# Altium project EPCI.PrjPcb
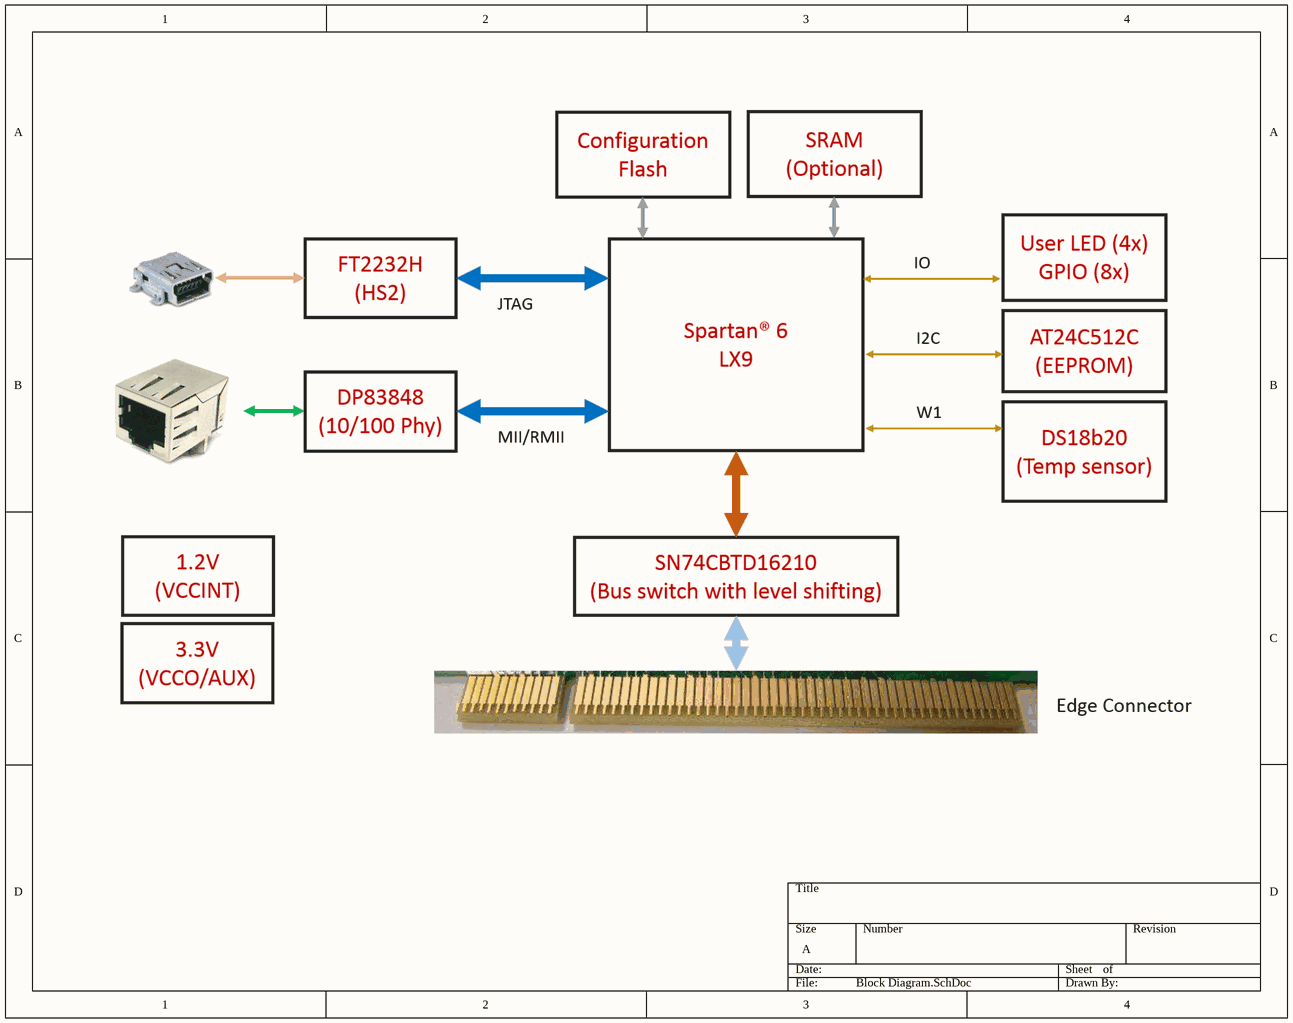
[diagram p0: Block Diagram.SchDoc]
10 sheets, 197 parts. Net scope: flat (ports and power ports of the same name join across sheets).
Board file: EPCI-V1.00.PcbDoc
Sheets:
  Block Diagram.SchDoc
  PCI-connector.SchDoc
  Network.SchDoc
  Power.SchDoc
  Programmer-JTAG.SchDoc
  Bus-switch.SchDoc
  Spartan6-Power.SchDoc
  Spartan6-IO01.SchDoc
  Spartan6-IO23.SchDoc
  Peripherals.SchDoc

## Sheet Block Diagram.SchDoc
size A

## Sheet PCI-connector.SchDoc
size A
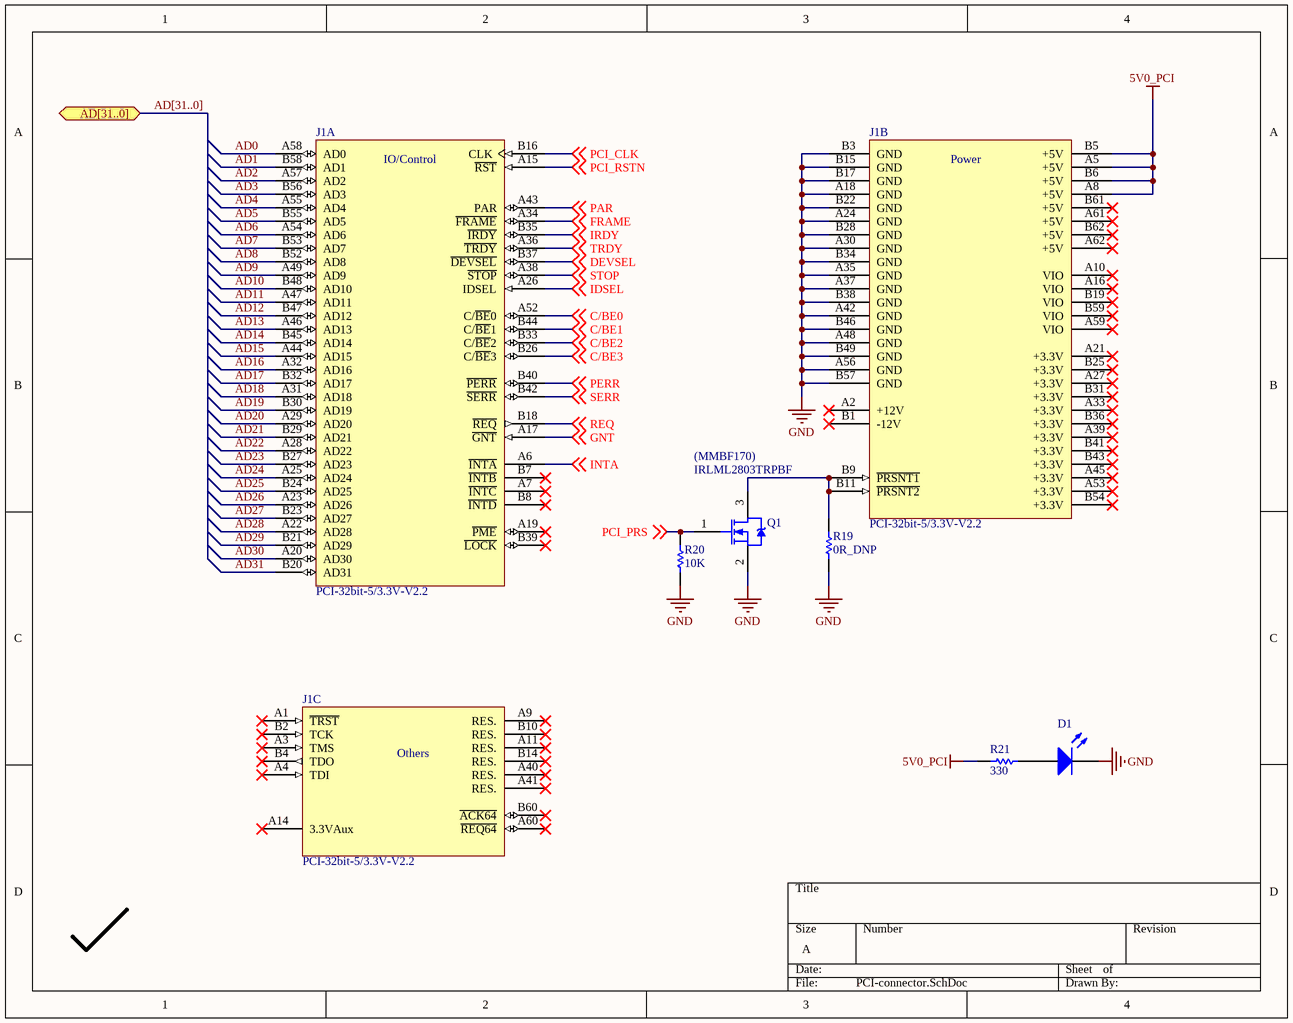
[diagram p1: PCI-connector.SchDoc]

### Parts
D1  LED0  [C0805]  (value not drawn)
J1  PCI-32bit-5/3.3V-V2.2  [PCI-32bit-5/3.3V-V2.2]  (parts A,B,C of 3)
Q1  IRLML2803TRPBF  [SOT23]
R19  value 0R_DNP  [0603PKG]  (hidden comment: Res Semi)
R20  value 10K  [0603PKG]  (hidden comment: Res Semi)
R21  value 330  [0603PKG]  (hidden comment: Res Semi)

### Ports
AD[31..0]

### Nets
5V0_PCI: J1.A5(+5V) J1.A8(+5V) J1.B5(+5V) J1.B6(+5V) R21.2
GND: D1.2(K) J1.A18(GND) J1.A24(GND) J1.A30(GND) J1.A35(GND) J1.A37(GND) J1.A42(GND) J1.A48(GND) J1.A56(GND) J1.B3(GND) J1.B15(GND) J1.B17(GND) J1.B22(GND) J1.B28(GND) J1.B34(GND) J1.B38(GND) J1.B46(GND) J1.B49(GND) J1.B57(GND) Q1.2(S) R19.2 R20.2
AD0: J1.A58(AD0)
AD1: J1.B58(AD1)
AD2: J1.A57(AD2)
AD3: J1.B56(AD3)
AD4: J1.A55(AD4)
AD5: J1.B55(AD5)
AD6: J1.A54(AD6)
AD7: J1.B53(AD7)
AD8: J1.B52(AD8)
AD9: J1.A49(AD9)
AD10: J1.B48(AD10)
AD11: J1.A47(AD11)
AD12: J1.B47(AD12)
AD13: J1.A46(AD13)
AD14: J1.B45(AD14)
AD15: J1.A44(AD15)
AD16: J1.A32(AD16)
AD17: J1.B32(AD17)
AD18: J1.A31(AD18)
AD19: J1.B30(AD19)
AD20: J1.A29(AD20)
AD21: J1.B29(AD21)
AD22: J1.A28(AD22)
AD23: J1.B27(AD23)
AD24: J1.A25(AD24)
AD25: J1.B24(AD25)
AD26: J1.A23(AD26)
AD27: J1.B23(AD27)
AD28: J1.A22(AD28)
AD29: J1.B21(AD29)
AD30: J1.A20(AD30)
AD31: J1.B20(AD31)
C/BE0: J1.A52(C/~{BE}0) ; off-sheet C/BE0
C/BE1: J1.B44(C/~{BE}1) ; off-sheet C/BE1
C/BE2: J1.B33(C/~{BE}2) ; off-sheet C/BE2
C/BE3: J1.B26(C/~{BE}3) ; off-sheet C/BE3
DEVSEL: J1.B37(~{DEVSEL}) ; off-sheet DEVSEL
FRAME: J1.A34(~{FRAME}) ; off-sheet FRAME
GNT: J1.A17(~{GNT}) ; off-sheet GNT
IDSEL: J1.A26(IDSEL) ; off-sheet IDSEL
INTA: J1.A6(~{INTA}) ; off-sheet INTA
IRDY: J1.B35(~{IRDY}) ; off-sheet IRDY
PAR: J1.A43(PAR) ; off-sheet PAR
PCI_CLK: J1.B16(CLK) ; off-sheet PCI_CLK
PCI_PRS: Q1.1(G) R20.1 ; off-sheet PCI_PRS
PCI_RSTN: J1.A15(~{RST}) ; off-sheet PCI_RSTN
PERR: J1.B40(~{PERR}) ; off-sheet PERR
REQ: J1.B18(~{REQ}) ; off-sheet REQ
SERR: J1.B42(~{SERR}) ; off-sheet SERR
STOP: J1.A38(~{STOP}) ; off-sheet STOP
TRDY: J1.A36(~{TRDY}) ; off-sheet TRDY
NetD1_1: D1.1(A) R21.1
NetJ1_B9: J1.B9(~{PRSNT1}) J1.B11(~{PRSNT2}) Q1.3(D) R19.1

Not connected (* = marked no-connect by the designer): J1 A1(~{TRST})* A2(+12V)* A3(TMS)* A4(TDI)* A7(~{INTC})* A9(RES.)* A10(VIO)* A11(RES.)* A14(3.3VAux)* A16(VIO)* A19(~{PME})* A21(+3.3V)* A27(+3.3V)* A33(+3.3V)* A39(+3.3V)* A40(RES.)* A41(RES.)* A45(+3.3V)* A53(+3.3V)* A59(VIO)* A60(~{REQ64})* A61(+5V)* A62(+5V)* B1(-12V)* B2(TCK)* B4(TDO)* B7(~{INTB})* B8(~{INTD})* B10(RES.)* B14(RES.)* B19(VIO)* B25(+3.3V)* B31(+3.3V)* B36(+3.3V)* B39(~{LOCK})* B41(+3.3V)* B43(+3.3V)* B54(+3.3V)* B59(VIO)* B60(~{ACK64})* B61(+5V)* B62(+5V)*

### Buses and harness runs
bus AD[31..0] = port AD[31..0]

### Notes on the sheet
- (MMBF170)
- (in symbol PCI-32bit-5/3.3V-V2.2, part A) IO/Control
- (in symbol PCI-32bit-5/3.3V-V2.2, part B) Power
- (in symbol PCI-32bit-5/3.3V-V2.2, part C) Others

### Library data of the parts
D1 = LED0: Typical INFRARED GaAs LED; Published: 8-Jun-2000; LatestRevisionDate: 08-Jul-2005; LatestRevisionNote: Mech Layer 1 removed.; PackageReference: LED-0; Publisher: Altium Limited; PackageDescription: LED; 2 Leads
Q1 = NMOS-2: N-Channel Power MOSFET; Note: Pin 2 is electrically connected to pin 4.; Published: 8-Jun-2000; LatestRevisionDate: 17-Jul-2002; LatestRevisionNote: Re-released for DXP Platform.; DatasheetVersion: PD-9.814; PackageVersion: Feb-1997; PackageReference: TO-220AB; Publisher: Altium Limited; PackageDescription: TO, Thru-Hole, Vertical, Heatsink Mounted; 3 In-Line Leads; Pitch 2.54 mm; ComponentLink1Description: Manufacturer Link; ComponentLink1URL: http://www.irf.com/
R19-R21 = Res Semi: Semiconductor Resistor; Published: 8-Jun-2000; LatestRevisionDate: 17-Jul-2002; LatestRevisionNote: Re-released for DXP Platform.; PackageReference: AXIAL-0.5; Publisher: Altium Limited; PackageDescription: Axial Device, Thru-Hole; 2 Leads; 0.5 in Pin Spacing

## Sheet Network.SchDoc
size A4
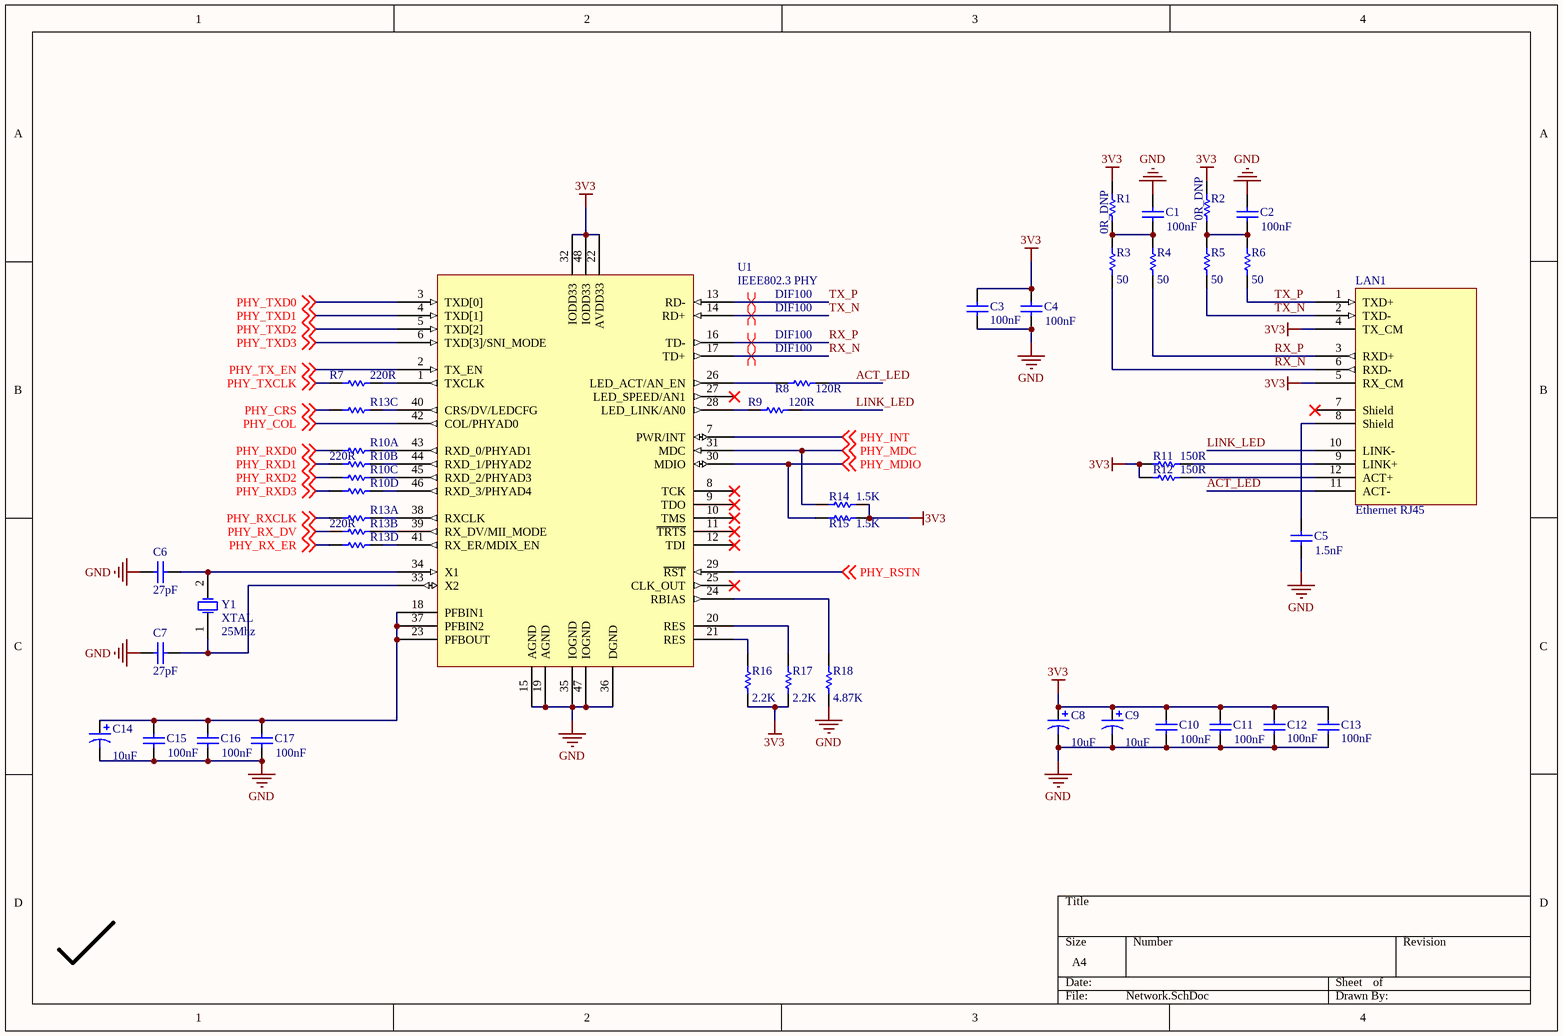
[diagram p2: Network.SchDoc]

### Parts
C1  value 100nF  [0603PKG]  (hidden comment: Cap)
C2  value 100nF  [0603PKG]  (hidden comment: Cap)
C3  value 100nF  [0603PKG]  (hidden comment: Cap)
C4  value 100nF  [0603PKG]  (hidden comment: Cap)
C5  value 1.5nF  [C0805]  (hidden comment: Cap)
C6  value 27pF  [C0805]  (hidden comment: Cap)
C7  value 27pF  [C0805]  (hidden comment: Cap)
C8  value 10uF  [3216X18N]  (hidden comment: Cap Pol3)
C9  value 10uF  [3216X18N]  (hidden comment: Cap Pol3)
C10  value 100nF  [0603PKG]  (hidden comment: Cap)
C11  value 100nF  [0603PKG]  (hidden comment: Cap)
C12  value 100nF  [0603PKG]  (hidden comment: Cap)
C13  value 100nF  [0603PKG]  (hidden comment: Cap)
C14  value 10uF  [3216X18N]  (hidden comment: Cap Pol3)
C15  value 100nF  [0603PKG]  (hidden comment: Cap)
C16  value 100nF  [0603PKG]  (hidden comment: Cap)
C17  value 100nF  [0603PKG]  (hidden comment: Cap)
LAN1  Ethernet RJ45  [RJ45]
R1  value 0R_DNP  [C0805]  (hidden comment: Res Semi)
R2  value 0R_DNP  [C0805]  (hidden comment: Res Semi)
R3  value 50  [C0805]  (hidden comment: Res Semi)
R4  value 50  [C0805]  (hidden comment: Res Semi)
R5  value 50  [C0805]  (hidden comment: Res Semi)
R6  value 50  [C0805]  (hidden comment: Res Semi)
R7  value 220R  [0603PKG]  (hidden comment: Res Semi)
R8  value 120R  [C0805]  (hidden comment: Res Semi)
R9  value 120R  [C0805]  (hidden comment: Res Semi)
R10  value 220R  [ARA4x0603]  (hidden comment: ChipArray_4x)  (parts A,B,C,D of 4)
R11  value 150R  [C0805]  (hidden comment: Res Semi)
R12  value 150R  [C0805]  (hidden comment: Res Semi)
R13  value 220R  [ARA4x0603]  (hidden comment: ChipArray_4x)  (parts A,B,C,D of 4)
R14  value 1.5K  [0603PKG]  (hidden comment: Res Semi)
R15  value 1.5K  [0603PKG]  (hidden comment: Res Semi)
R16  value 2.2K  [0603PKG]  (hidden comment: Res Semi)
R17  value 2.2K  [0603PKG]  (hidden comment: Res Semi)
R18  value 4.87K  [C1206]  (hidden comment: Res Semi)
U1  IEEE802.3 PHY  [LQFP48]
Y1  XTAL  value 25Mhz  [SMD_Crystal]

### Nets
3V3: C3.1 C4.2 C8.1 C9.1 C10.2 C11.2 C12.2 C13.2 LAN1.4(TX_CM) LAN1.5(RX_CM) R1.2 R2.2 R11.1 R12.1 R14.2 R15.1 R16.1 R17.1 U1.22(AVDD33) U1.32(IODD33) U1.48(IODD33)
GND: C1.2 C2.2 C3.2 C4.1 C5.1 C6.2 C7.2 C8.2 C9.2 C10.1 C11.1 C12.1 C13.1 C14.2 C15.1 C16.1 C17.1 R18.1 U1.15(AGND) U1.19(AGND) U1.35(IOGND) U1.36(DGND) U1.47(IOGND)
ACT_LED: LAN1.11(ACT-) R8.2
LINK_LED: LAN1.10(LINK-) R9.2
PHY_COL: U1.42(COL/PHYAD0) ; off-sheet PHY_COL
PHY_CRS: R13.3(R3) ; off-sheet PHY_CRS
PHY_INT: U1.7(PWR/INT) ; off-sheet PHY_INT
PHY_MDC: R14.1 U1.31(MDC) ; off-sheet PHY_MDC
PHY_MDIO: R15.2 U1.30(MDIO) ; off-sheet PHY_MDIO
PHY_RSTN: U1.29(~{RST}) ; off-sheet PHY_RSTN
PHY_RX_DV: R13.2(R2) ; off-sheet PHY_RX_DV
PHY_RX_ER: R13.4(R4) ; off-sheet PHY_RX_ER
PHY_RXCLK: R13.1(R1) ; off-sheet PHY_RXCLK
PHY_RXD0: R10.1(R1) ; off-sheet PHY_RXD0
PHY_RXD1: R10.2(R2) ; off-sheet PHY_RXD1
PHY_RXD2: R10.3(R3) ; off-sheet PHY_RXD2
PHY_RXD3: R10.4(R4) ; off-sheet PHY_RXD3
PHY_TX_EN: U1.2(TX_EN) ; off-sheet PHY_TX_EN
PHY_TXCLK: R7.1 ; off-sheet PHY_TXCLK
PHY_TXD0: U1.3(TXD[0]) ; off-sheet PHY_TXD0
PHY_TXD1: U1.4(TXD[1]) ; off-sheet PHY_TXD1
PHY_TXD2: U1.5(TXD[2]) ; off-sheet PHY_TXD2
PHY_TXD3: U1.6(TXD[3]/SNI_MODE) ; off-sheet PHY_TXD3
RX_N: LAN1.6(RXD-) R3.1 U1.17(TD+)
RX_P: LAN1.3(RXD+) R4.1 U1.16(TD-)
TX_N: LAN1.2(TXD-) R5.1 U1.14(RD+)
TX_P: LAN1.1(TXD+) R6.1 U1.13(RD-)
NetC1_1: C1.1 R1.1 R3.2 R4.2
NetC2_1: C2.1 R2.1 R5.2 R6.2
NetC5_2: C5.2 LAN1.8(Shield)
NetC6_1: C6.1 U1.34(X1) Y1.2(OSC2)
NetC7_1: C7.1 U1.33(X2) Y1.1(OSC1)
NetC14_1: C14.1 C15.2 C16.2 C17.2 U1.18(PFBIN1) U1.23(PFBOUT) U1.37(PFBIN2)
NetLAN1_9: LAN1.9(LINK+) R11.2
NetLAN1_12: LAN1.12(ACT+) R12.2
NetR7_2: R7.2 U1.1(TXCLK)
NetR8_1: R8.1 U1.26(LED_ACT/AN_EN)
NetR9_1: R9.1 U1.28(LED_LINK/AN0)
NetR10_5: R10.5(R4) U1.46(RXD_3/PHYAD4)
NetR10_6: R10.6(R3) U1.45(RXD_2/PHYAD3)
NetR10_7: R10.7(R2) U1.44(RXD_1/PHYAD2)
NetR10_8: R10.8(R1) U1.43(RXD_0/PHYAD1)
NetR13_5: R13.5(R4) U1.41(RX_ER/MDIX_EN)
NetR13_6: R13.6(R3) U1.40(CRS/DV/LEDCFG)
NetR13_7: R13.7(R2) U1.39(RX_DV/MII_MODE)
NetR13_8: R13.8(R1) U1.38(RXCLK)
NetR16_2: R16.2 U1.21(RES)
NetR17_2: R17.2 U1.20(RES)
NetR18_2: R18.2 U1.24(RBIAS)

Not connected (* = marked no-connect by the designer): LAN1 7(Shield)*; U1 8(TCK)* 9(TDO)* 10(TMS)* 11(~{TRTS})* 12(TDI)* 25(CLK_OUT)* 27(LED_SPEED/AN1)*

### Layout directives
differential pair; net class DIF100: RX_N, RX_P, TX_N, TX_P

### Library data of the parts
C1-C7 C10-C13 C15-C17 = Cap: Capacitor; Published: 8-Jun-2000; LatestRevisionDate: 17-Jul-2002; LatestRevisionNote: Re-released for DXP Platform.; PackageReference: RAD-0.3; Publisher: Altium Limited; PackageDescription: Radial Cap, Thru-Hole; 2 Leads; 0.3 in Pin Spacing
C8 C9 C14 = Cap Pol3: Polarized Capacitor (Surface Mount); Published: 8-Jun-2000; LatestRevisionDate: 29-May-2009; LatestRevisionNote: IPC-7351 Footprint Added.; PackageReference: C0805; Publisher: Altium Limited; PackageDescription: Chip Capacitor
LAN1 = Ethernet_RJ45
R1-R9 R11 R12 R14-R18 = Res Semi: Semiconductor Resistor; Published: 8-Jun-2000; LatestRevisionDate: 17-Jul-2002; LatestRevisionNote: Re-released for DXP Platform.; PackageReference: AXIAL-0.5; Publisher: Altium Limited; PackageDescription: Axial Device, Thru-Hole; 2 Leads; 0.5 in Pin Spacing
U1 = DP83848C
Y1 = XTAL: Crystal Oscillator; Published: 8-Jun-2000; LatestRevisionDate: 17-Jul-2002; LatestRevisionNote: Re-released for DXP Platform.; PackageReference: R38; Publisher: Altium Limited; PackageDescription: Crystal, Thru-Hole; 2 Leads; Body 3.1 x 8.2 mm (Dia.xH)

## Sheet Power.SchDoc
size A
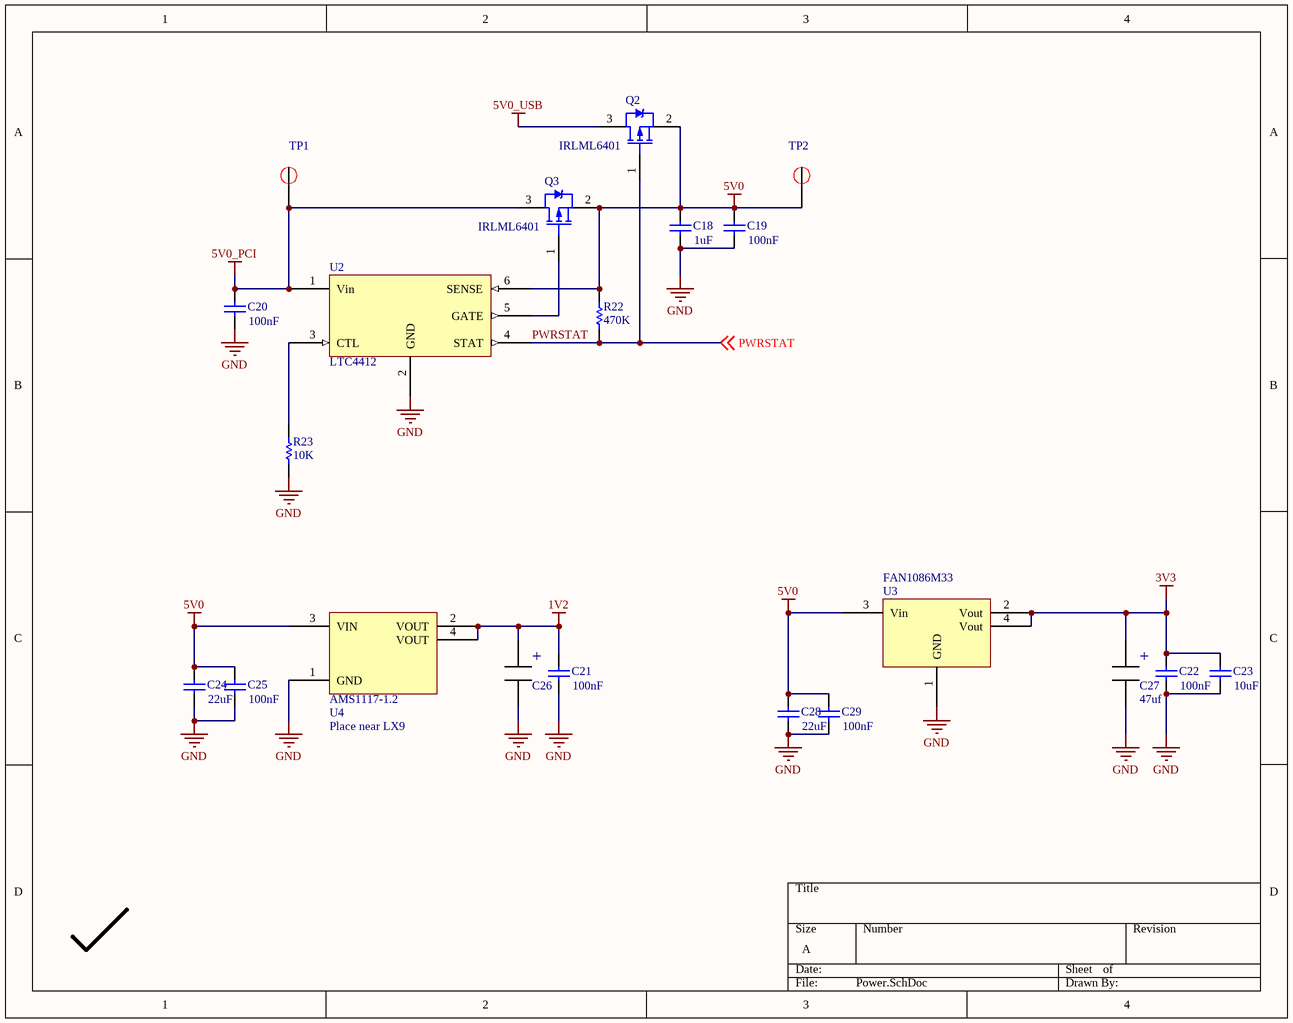
[diagram p3: Power.SchDoc]

### Parts
C18  value 1uF  [0603PKG]  (hidden comment: Cap)
C19  value 100nF  [0603PKG]  (hidden comment: Cap)
C20  value 100nF  [0603PKG]  (hidden comment: Cap)
C21  value 100nF  [C0805]  (hidden comment: Cap)
C22  value 100nF  [C0805]  (hidden comment: Cap)
C23  value 10uF  [C0805]  (hidden comment: Cap)
C24  value 22uF  [C1206]  (hidden comment: Cap)
C25  value 100nF  [C0805]  (hidden comment: Cap)
C26  Capacitor  [Capacitor]  (value not drawn)
C27  value 47uf  [Capacitor]  (hidden comment: Capacitor)
C28  value 22uF  [C1206]  (hidden comment: Cap)
C29  value 100nF  [C0805]  (hidden comment: Cap)
Q2  IRLML6401  [SOT23]
Q3  IRLML6401  [SOT23]
R22  value 470K  [0603PKG]  (hidden comment: Res Semi)
R23  value 10K  [0603PKG]  (hidden comment: Res Semi)
TP1  TP  [TP_15]  (value not drawn)
TP2  TP  [TP_15]  (value not drawn)
U2  LTC4412  [SOT23-6]
U3  FAN1086M33  [TO263]
U4  AMS1117-1.2  [SOT223]

### Nets
1V2: C21.2 C26.2 U4.2(VOUT) U4.4(VOUT)
3V3: C22.2 C23.2 C27.2 U3.2(Vout) U3.4(Vout)
5V0: C18.2 C19.2 C24.2 C25.2 C28.2 C29.2 Q2.2(S) Q3.2(S) R22.2 TP2.1 U2.6(SENSE) U3.3(Vin) U4.3(VIN)
5V0_PCI: C20.2 Q3.3(D) TP1.1 U2.1(Vin)
5V0_USB: Q2.3(D)
GND: C18.1 C19.1 C20.1 C21.1 C22.1 C23.1 C24.1 C25.1 C26.1 C27.1 C28.1 C29.1 R23.1 U2.2(GND) U3.1(GND) U4.1(GND)
PWRSTAT: Q2.1(G) R22.1 U2.4(STAT) ; off-sheet PWRSTAT
NetQ3_1: Q3.1(G) U2.5(GATE)
NetR23_2: R23.2 U2.3(CTL)

### Notes on the sheet
- (near U4) Place near LX9
- (in symbol SMS capacitor) +

### Library data of the parts
C18-C25 C28 C29 = Cap: Capacitor; Published: 8-Jun-2000; LatestRevisionDate: 17-Jul-2002; LatestRevisionNote: Re-released for DXP Platform.; PackageReference: RAD-0.3; Publisher: Altium Limited; PackageDescription: Radial Cap, Thru-Hole; 2 Leads; 0.3 in Pin Spacing
C26 = SMS capacitor: Value: 47uf
C27 = SMS capacitor
Q2 Q3 = PMOS-2: P-Channel Power MOSFET; Note: Pin 4 not drawn and electrically connected to Pin 2.; Published: 8-Jun-2000; LatestRevisionDate: 17-Jul-2002; LatestRevisionNote: Re-released for DXP Platform.; DatasheetVersion: PD-9.390D; PackageVersion: Feb-1997; PackageReference: TO-220AB; Publisher: Altium Limited; PackageDescription: TO, Thru-Hole, Vertical, Heatsink Mounted; 3 In-Line Leads; Pitch 2.54 mm; ComponentLink1Description: Manufacturer Link; ComponentLink1URL: http://www.irf.com/
R22 R23 = Res Semi: Semiconductor Resistor; Published: 8-Jun-2000; LatestRevisionDate: 17-Jul-2002; LatestRevisionNote: Re-released for DXP Platform.; PackageReference: AXIAL-0.5; Publisher: Altium Limited; PackageDescription: Axial Device, Thru-Hole; 2 Leads; 0.5 in Pin Spacing
TP1 TP2 = Test Point
U2 = LTC4412: Low Loss PowerPath™  Controller in ThinSOT
U4 = AMS1117-1.2: 1A Adjustable/Fixed Low Dropout Linear Regulator

## Sheet Programmer-JTAG.SchDoc
size A
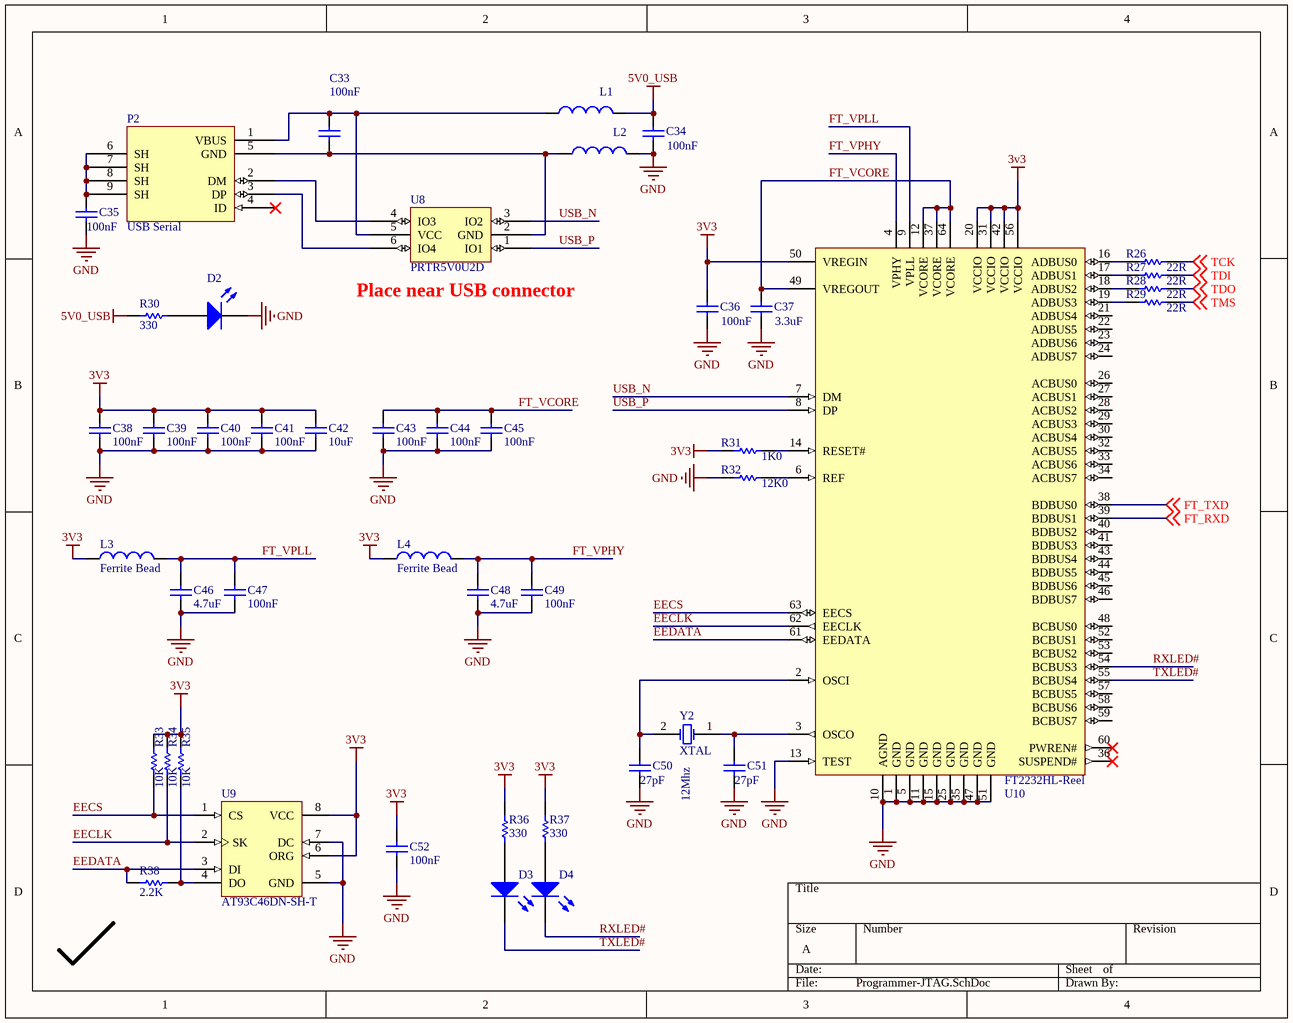
[diagram p4: Programmer-JTAG.SchDoc]

### Parts
C33  value 100nF  [C0805]  (hidden comment: Cap)
C34  value 100nF  [C0805]  (hidden comment: Cap)
C35  value 100nF  [C0805]  (hidden comment: Cap)
C36  value 100nF  [0603PKG]  (hidden comment: Cap)
C37  value 3.3uF  [C0805]  (hidden comment: Cap)
C38  value 100nF  [0603PKG]  (hidden comment: Cap Semi)
C39  value 100nF  [0603PKG]  (hidden comment: Cap Semi)
C40  value 100nF  [0603PKG]  (hidden comment: Cap Semi)
C41  value 100nF  [0603PKG]  (hidden comment: Cap Semi)
C42  value 10uF  [0603PKG]  (hidden comment: Cap Semi)
C43  value 100nF  [0603PKG]  (hidden comment: Cap Semi)
C44  value 100nF  [0603PKG]  (hidden comment: Cap Semi)
C45  value 100nF  [0603PKG]  (hidden comment: Cap Semi)
C46  value 4.7uF  [0603PKG]  (hidden comment: Cap Semi)
C47  value 100nF  [0603PKG]  (hidden comment: Cap Semi)
C48  value 4.7uF  [0603PKG]  (hidden comment: Cap Semi)
C49  value 100nF  [0603PKG]  (hidden comment: Cap Semi)
C50  value 27pF  [0603PKG]  (hidden comment: Cap)
C51  value 27pF  [0603PKG]  (hidden comment: Cap)
C52  value 100nF  [0603PKG]  (hidden comment: Cap Semi)
D2  LED0  [C0805]  (value not drawn)
D3  LED0  [C0805]  (value not drawn)
D4  LED0  [C0805]  (value not drawn)
L1  Ferrite Bead  [C0805]  (value not drawn)
L2  Ferrite Bead  [C0805]  (value not drawn)
L3  Ferrite Bead  [C0805]
L4  Ferrite Bead  [C0805]
P2  USB Serial  [Mini USB]
R26  value 22R  [0603PKG]  (hidden comment: Res Semi)
R27  value 22R  [0603PKG]  (hidden comment: Res Semi)
R28  value 22R  [0603PKG]  (hidden comment: Res Semi)
R29  value 22R  [0603PKG]  (hidden comment: Res Semi)
R30  value 330  [0603PKG]  (hidden comment: Res Semi)
R31  value 1K0  [0603PKG]  (hidden comment: Res Semi)
R32  value 12K0  [0603PKG]  (hidden comment: Res Semi)
R33  value 10K  [0603PKG]  (hidden comment: Res Semi)
R34  value 10K  [0603PKG]  (hidden comment: Res Semi)
R35  value 10K  [0603PKG]  (hidden comment: Res Semi)
R36  value 330  [0603PKG]  (hidden comment: Res Semi)
R37  value 330  [0603PKG]  (hidden comment: Res Semi)
R38  value 2.2K  [0603PKG]  (hidden comment: Res Semi)
U8  PRTR5V0U2D  [SOT457]
U9  AT93C46DN-SH-T  [8S1_N]
U10  FT2232HL-Reel  [LQFP-64_N]
Y2  XTAL  value 12Mhz  [SMD_Crystal]

### Nets
3V3: C36.2 C38.2 C39.2 C40.2 C41.2 C42.2 C52.2 L3.1 L4.1 R31.2 R33.1 R34.1 R35.1 R36.2 R37.2 U9.6(ORG) U9.8(VCC) U10.20(VCCIO) U10.31(VCCIO) U10.42(VCCIO) U10.50(VREGIN) U10.56(VCCIO)
5V0_USB: C34.2 L1.2 R30.2
GND: C34.1 C35.1 C36.1 C37.1 C38.1 C39.1 C40.1 C41.1 C42.1 C43.1 C44.1 C45.1 C46.1 C47.1 C48.1 C49.1 C50.1 C51.1 C52.1 D2.2(K) L2.2 R32.2 U9.5(GND) U9.7(DC) U10.1(GND) U10.5(GND) U10.10(AGND) U10.11(GND) U10.13(TEST) U10.15(GND) U10.25(GND) U10.35(GND) U10.47(GND) U10.51(GND)
EECLK: R34.2 U9.2(SK) U10.62(EECLK)
EECS: R33.2 U9.1(CS) U10.63(EECS)
EEDATA: R38.2 U9.3(DI) U10.61(EEDATA)
FT_RXD: U10.39(BDBUS1) ; off-sheet FT_RXD
FT_TXD: U10.38(BDBUS0) ; off-sheet FT_TXD
FT_VCORE: C37.2 C43.2 C44.2 C45.2 U10.12(VCORE) U10.37(VCORE) U10.49(VREGOUT) U10.64(VCORE)
FT_VPHY: C48.2 C49.2 L4.2 U10.4(VPHY)
FT_VPLL: C46.2 C47.2 L3.2 U10.9(VPLL)
RXLED#: D4.2(K) U10.54(BCBUS3)
TCK: R26.1 ; off-sheet TCK
TDI: R27.1 ; off-sheet TDI
TDO: R28.1 ; off-sheet TDO
TMS: R29.1 ; off-sheet TMS
TXLED#: D3.2(K) U10.55(BCBUS4)
USB_N: U8.3(IO2) U10.7(DM)
USB_P: U8.1(IO1) U10.8(DP)
NetC33_1: C33.1 L2.1 P2.5(GND) U8.2(GND)
NetC33_2: C33.2 L1.1 P2.1(VBUS) U8.5(VCC)
NetC35_2: C35.2 P2.6(SH) P2.7(SH) P2.8(SH) P2.9(SH)
NetC50_2: C50.2 U10.2(OSCI) Y2.2(OSC2)
NetC51_2: C51.2 U10.3(OSCO) Y2.1(OSC1)
NetD2_1: D2.1(A) R30.1
NetD3_1: D3.1(A) R36.1
NetD4_1: D4.1(A) R37.1
NetP2_2: P2.2(DM) U8.4(IO3)
NetP2_3: P2.3(DP) U8.6(IO4)
NetR26_2: R26.2 U10.16(ADBUS0)
NetR27_2: R27.2 U10.17(ADBUS1)
NetR28_2: R28.2 U10.18(ADBUS2)
NetR29_2: R29.2 U10.19(ADBUS3)
NetR31_1: R31.1 U10.14(RESET#)
NetR32_1: R32.1 U10.6(REF)
NetR35_2: R35.2 R38.1 U9.4(DO)

Not connected (* = marked no-connect by the designer): P2 4(ID)*; U10 21(ADBUS4) 22(ADBUS5) 23(ADBUS6) 24(ADBUS7) 26(ACBUS0) 27(ACBUS1) 28(ACBUS2) 29(ACBUS3) 30(ACBUS4) 32(ACBUS5) 33(ACBUS6) 34(ACBUS7) 36(SUSPEND#)* 40(BDBUS2) 41(BDBUS3) 43(BDBUS4) 44(BDBUS5) 45(BDBUS6) 46(BDBUS7) 48(BCBUS0) 52(BCBUS1) 53(BCBUS2) 57(BCBUS5) 58(BCBUS6) 59(BCBUS7) 60(PWREN#)*

### Notes on the sheet
- (near U8) Place near USB connector

### Library data of the parts
C33-C37 C50 C51 = Cap: Capacitor; Published: 8-Jun-2000; LatestRevisionDate: 17-Jul-2002; LatestRevisionNote: Re-released for DXP Platform.; PackageReference: RAD-0.3; Publisher: Altium Limited; PackageDescription: Radial Cap, Thru-Hole; 2 Leads; 0.3 in Pin Spacing
C38-C49 C52 = Cap Semi: Capacitor (Semiconductor SIM Model); Published: 8-Jun-2000; LatestRevisionDate: 29-May-2009; LatestRevisionNote: IPC-7351 Footprint Added.; PackageReference: C1206; Publisher: Altium Limited; PackageDescription: Chip Capacitor
D2-D4 = LED0: Typical INFRARED GaAs LED; Published: 8-Jun-2000; LatestRevisionDate: 08-Jul-2005; LatestRevisionNote: Mech Layer 1 removed.; PackageReference: LED-0; Publisher: Altium Limited; PackageDescription: LED; 2 Leads
L1-L4 = Inductor: Code_IEC: 1005; Value: 10mH; Published: 8-Jun-2000; LatestRevisionDate: 29-May-2009; LatestRevisionNote: IPC-7351 Footprint Added.; PackageReference: 0402-A; Publisher: Altium Limited; PackageDescription: Chip Inductor; Code_JEITA: 0402
P2 = Mini USB
R26-R38 = Res Semi: Semiconductor Resistor; Published: 8-Jun-2000; LatestRevisionDate: 17-Jul-2002; LatestRevisionNote: Re-released for DXP Platform.; PackageReference: AXIAL-0.5; Publisher: Altium Limited; PackageDescription: Axial Device, Thru-Hole; 2 Leads; 0.5 in Pin Spacing
U8 = PRTR5V0U2D: TVS Zener
U9 = AT93C46DN-SP25-B: 1Kbit (128 x 8 or 64 x 16), 3-wire Bus Serial Automotive EEPROM, 2.5V, 8-Pin SOIC, Bulk; DatasheetVersion: 8674B,  Oct-2009; PackageVersion: revC, Mar-2005; PackageReference: 8S1; PackageDescription: 8-Lead (0.150" Wide Body), Plastic Gull Wing Small Outline (JEDEC SOIC); Code_JEDEC: MS-012-AA; Code_IPC: SOIC127P600-8; ComponentLink1Description: Manufacturer URL; ComponentLink1URL: http://www.atmel.com/; ComponentLink2Description: Datasheet; ComponentLink2URL: http://www.atmel.com/dyn/resources/prod_documents/doc8674.pdf
U10 = FT2232HL-Reel: Dual High Speed USB To Multipurpose UART/FIFO IC, 64-pin LQFP, Tape and Reel; Manufacturer: FTDI; DatasheetVersion: ver 2.21, Jun-2012; PackageVersion: Jun-12; PackageReference: LQFP-64; PackageDescription: 64-Pin Thin Quad Flat Pack, 10 x 10 x 1.4 mm Body, 0.5 mm Pitch; PartNumber: FT2232HL-Reel; ComponentLink1Description: Manufacturer URL; ComponentLink1URL: http://www.ftdichip.com/; ComponentLink2Description: Datasheet; ComponentLink2URL: http://www.ftdichip.com/Support/Documents/DataSheets/ICs/DS_FT2232H.pdf
Y2 = XTAL: Crystal Oscillator; Published: 8-Jun-2000; LatestRevisionDate: 17-Jul-2002; LatestRevisionNote: Re-released for DXP Platform.; PackageReference: R38; Publisher: Altium Limited; PackageDescription: Crystal, Thru-Hole; 2 Leads; Body 3.1 x 8.2 mm (Dia.xH)

## Sheet Bus-switch.SchDoc
size B
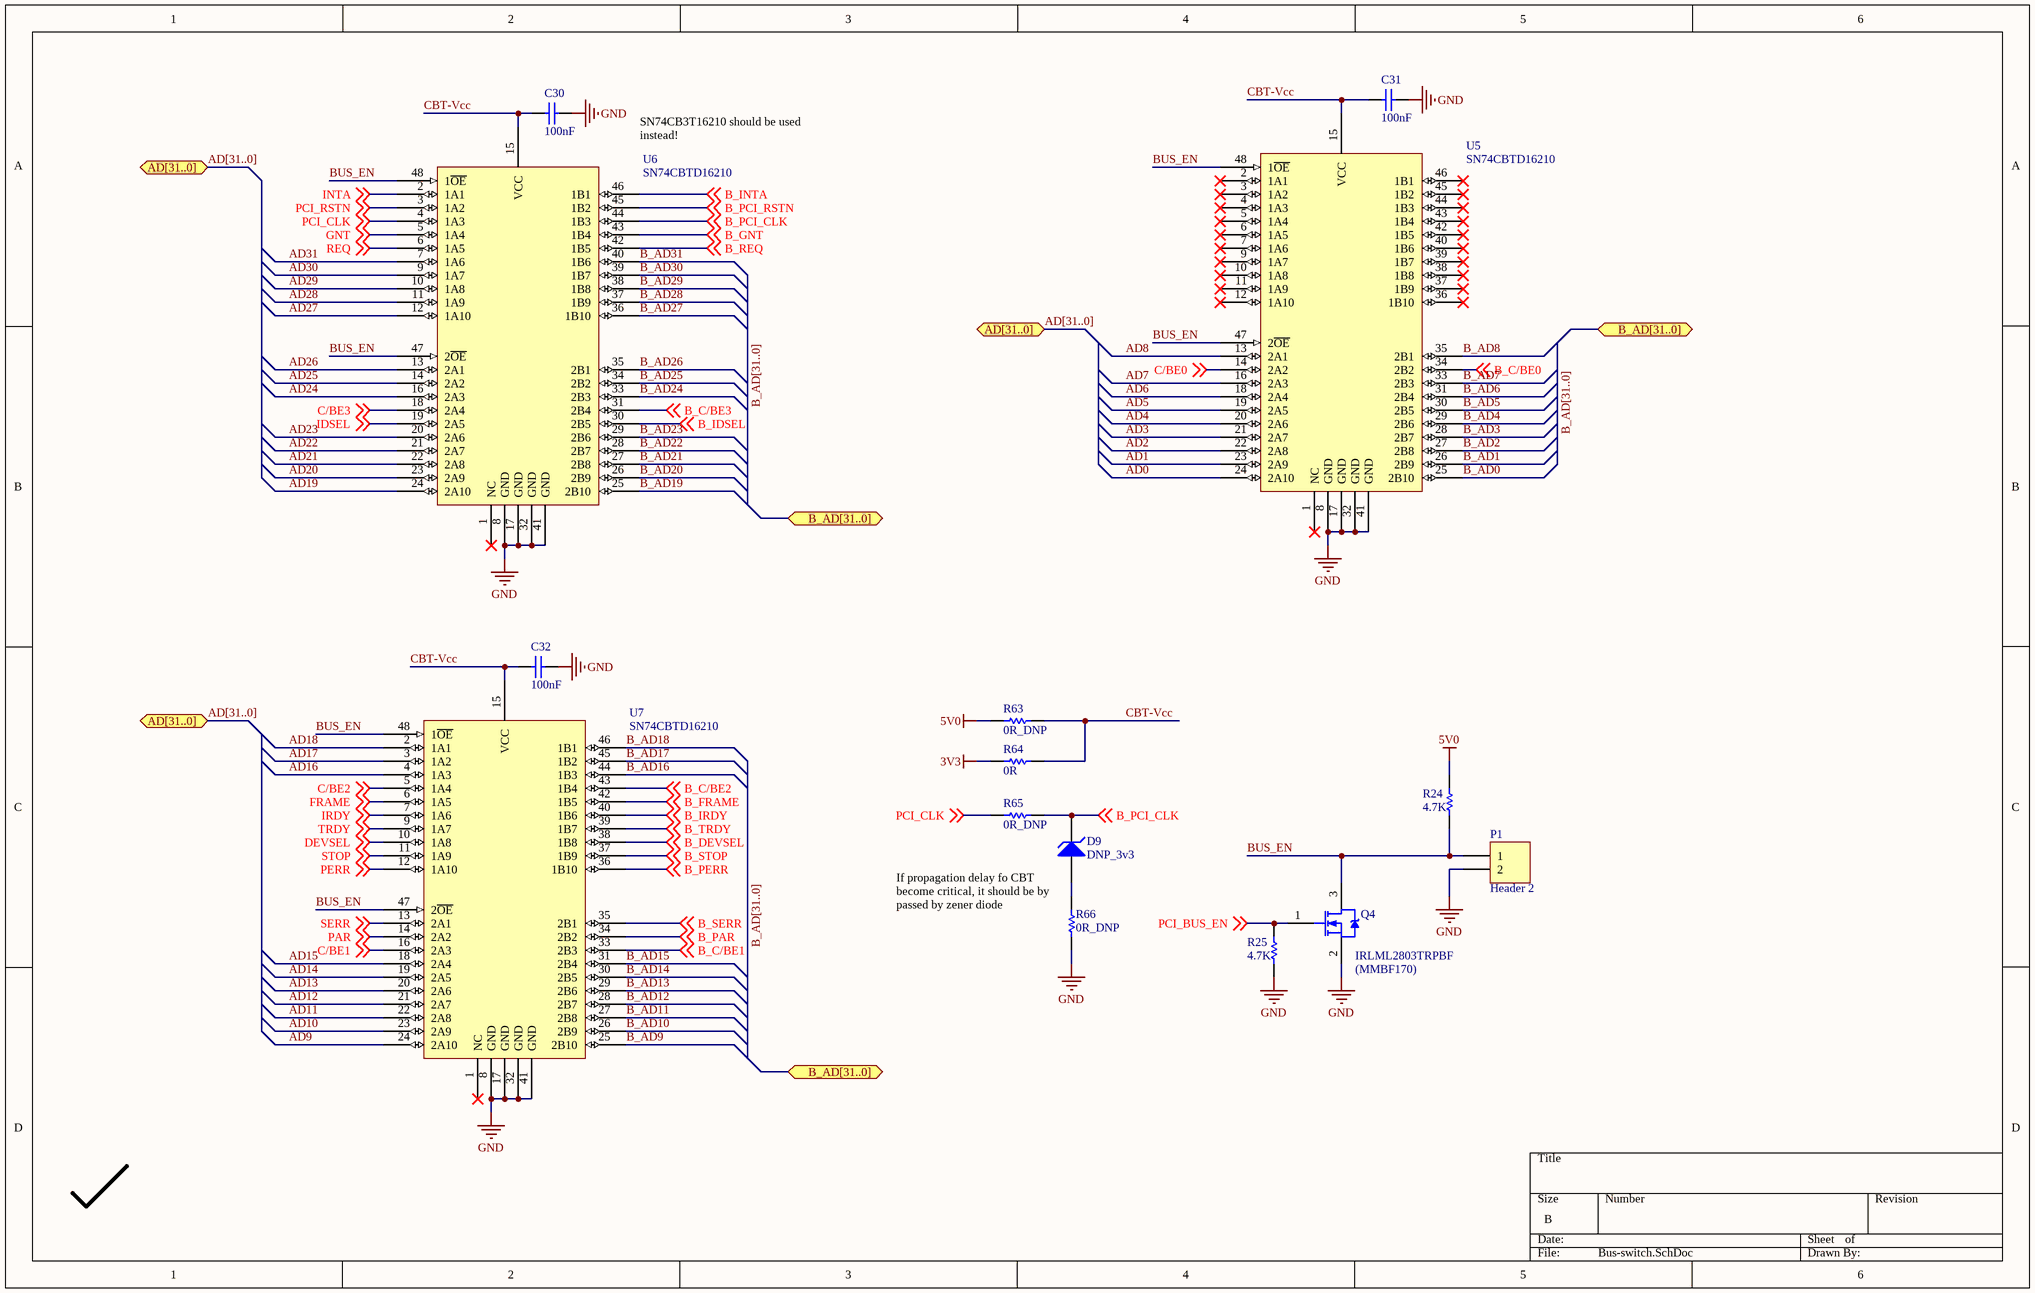
[diagram p5: Bus-switch.SchDoc]

### Parts
C30  value 100nF  [0603PKG]  (hidden comment: Cap Semi)
C31  value 100nF  [0603PKG]  (hidden comment: Cap Semi)
C32  value 100nF  [0603PKG]  (hidden comment: Cap Semi)
D9  DNP_3v3  [C1206]
P1  Header 2  [HDR1X2]
Q4  IRLML2803TRPBF  [SOT23]
R24  value 4.7K  [0603PKG]  (hidden comment: Res1)
R25  value 4.7K  [0603PKG]  (hidden comment: Res1)
R63  value 0R_DNP  [0603PKG]  (hidden comment: Res1)
R64  value 0R  [0603PKG]  (hidden comment: Res1)
R65  value 0R_DNP  [0603PKG]  (hidden comment: Res1)
R66  value 0R_DNP  [0603PKG]  (hidden comment: Res1)
U5  SN74CBTD16210  [TSSOP-48-DGG]
U6  SN74CBTD16210  [TSSOP-48-DGG]
U7  SN74CBTD16210  [TSSOP-48-DGG]

### Ports
AD[31..0], B_AD[31..0]

### Nets
3V3: R64.2
5V0: R24.2 R63.2
GND: C30.1 C31.1 C32.1 P1.2 Q4.2(S) R25.1 R66.2 U5.8(GND) U5.17(GND) U5.32(GND) U5.41(GND) U6.8(GND) U6.17(GND) U6.32(GND) U6.41(GND) U7.8(GND) U7.17(GND) U7.32(GND) U7.41(GND)
AD0: U5.24(2A10)
AD1: U5.23(2A9)
AD2: U5.22(2A8)
AD3: U5.21(2A7)
AD4: U5.20(2A6)
AD5: U5.19(2A5)
AD6: U5.18(2A4)
AD7: U5.16(2A3)
AD8: U5.13(2A1)
AD9: U7.24(2A10)
AD10: U7.23(2A9)
AD11: U7.22(2A8)
AD12: U7.21(2A7)
AD13: U7.20(2A6)
AD14: U7.19(2A5)
AD15: U7.18(2A4)
AD16: U7.4(1A3)
AD17: U7.3(1A2)
AD18: U7.2(1A1)
AD19: U6.24(2A10)
AD20: U6.23(2A9)
AD21: U6.22(2A8)
AD22: U6.21(2A7)
AD23: U6.20(2A6)
AD24: U6.16(2A3)
AD25: U6.14(2A2)
AD26: U6.13(2A1)
AD27: U6.12(1A10)
AD28: U6.11(1A9)
AD29: U6.10(1A8)
AD30: U6.9(1A7)
AD31: U6.7(1A6)
B_AD0: U5.25(2B10)
B_AD1: U5.26(2B9)
B_AD2: U5.27(2B8)
B_AD3: U5.28(2B7)
B_AD4: U5.29(2B6)
B_AD5: U5.30(2B5)
B_AD6: U5.31(2B4)
B_AD7: U5.33(2B3)
B_AD8: U5.35(2B1)
B_AD9: U7.25(2B10)
B_AD10: U7.26(2B9)
B_AD11: U7.27(2B8)
B_AD12: U7.28(2B7)
B_AD13: U7.29(2B6)
B_AD14: U7.30(2B5)
B_AD15: U7.31(2B4)
B_AD16: U7.44(1B3)
B_AD17: U7.45(1B2)
B_AD18: U7.46(1B1)
B_AD19: U6.25(2B10)
B_AD20: U6.26(2B9)
B_AD21: U6.27(2B8)
B_AD22: U6.28(2B7)
B_AD23: U6.29(2B6)
B_AD24: U6.33(2B3)
B_AD25: U6.34(2B2)
B_AD26: U6.35(2B1)
B_AD27: U6.36(1B10)
B_AD28: U6.37(1B9)
B_AD29: U6.38(1B8)
B_AD30: U6.39(1B7)
B_AD31: U6.40(1B6)
B_C/BE0: U5.34(2B2) ; off-sheet B_C/BE0
B_C/BE1: U7.33(2B3) ; off-sheet B_C/BE1
B_C/BE2: U7.43(1B4) ; off-sheet B_C/BE2
B_C/BE3: U6.31(2B4) ; off-sheet B_C/BE3
B_DEVSEL: U7.38(1B8) ; off-sheet B_DEVSEL
B_FRAME: U7.42(1B5) ; off-sheet B_FRAME
B_GNT: U6.43(1B4) ; off-sheet B_GNT
B_IDSEL: U6.30(2B5) ; off-sheet B_IDSEL
B_INTA: U6.46(1B1) ; off-sheet B_INTA
B_IRDY: U7.40(1B6) ; off-sheet B_IRDY
B_PAR: U7.34(2B2) ; off-sheet B_PAR
B_PCI_CLK: D9.2(K) R65.1 U6.44(1B3) ; off-sheet B_PCI_CLK
B_PCI_RSTN: U6.45(1B2) ; off-sheet B_PCI_RSTN
B_PERR: U7.36(1B10) ; off-sheet B_PERR
B_REQ: U6.42(1B5) ; off-sheet B_REQ
B_SERR: U7.35(2B1) ; off-sheet B_SERR
B_STOP: U7.37(1B9) ; off-sheet B_STOP
B_TRDY: U7.39(1B7) ; off-sheet B_TRDY
BUS_EN: P1.1 Q4.3(D) R24.1 U5.47(2~{OE}) U5.48(1~{OE}) U6.47(2~{OE}) U6.48(1~{OE}) U7.47(2~{OE}) U7.48(1~{OE})
C/BE0: U5.14(2A2) ; off-sheet C/BE0
C/BE1: U7.16(2A3) ; off-sheet C/BE1
C/BE2: U7.5(1A4) ; off-sheet C/BE2
C/BE3: U6.18(2A4) ; off-sheet C/BE3
CBT-Vcc: C30.2 C31.2 C32.2 R63.1 R64.1 U5.15(VCC) U6.15(VCC) U7.15(VCC)
DEVSEL: U7.10(1A8) ; off-sheet DEVSEL
FRAME: U7.6(1A5) ; off-sheet FRAME
GNT: U6.5(1A4) ; off-sheet GNT
IDSEL: U6.19(2A5) ; off-sheet IDSEL
INTA: U6.2(1A1) ; off-sheet INTA
IRDY: U7.7(1A6) ; off-sheet IRDY
PAR: U7.14(2A2) ; off-sheet PAR
PCI_BUS_EN: Q4.1(G) R25.2 ; off-sheet PCI_BUS_EN
PCI_CLK: R65.2 U6.4(1A3) ; off-sheet PCI_CLK
PCI_RSTN: U6.3(1A2) ; off-sheet PCI_RSTN
PERR: U7.12(1A10) ; off-sheet PERR
REQ: U6.6(1A5) ; off-sheet REQ
SERR: U7.13(2A1) ; off-sheet SERR
STOP: U7.11(1A9) ; off-sheet STOP
TRDY: U7.9(1A7) ; off-sheet TRDY
NetD9_1: D9.1(A) R66.1

Not connected (* = marked no-connect by the designer): U5 1(NC)* 2(1A1)* 3(1A2)* 4(1A3)* 5(1A4)* 6(1A5)* 7(1A6)* 9(1A7)* 10(1A8)* 11(1A9)* 12(1A10)* 36(1B10)* 37(1B9)* 38(1B8)* 39(1B7)* 40(1B6)* 42(1B5)* 43(1B4)* 44(1B3)* 45(1B2)* 46(1B1)*; U6 1(NC)*; U7 1(NC)*

### Buses and harness runs
bus AD[31..0] = port AD[31..0]
bus B_AD[31..0] = port B_AD[31..0]

### Notes on the sheet
- (near U6) SN74CB3T16210 should be used instead!
- If propagation delay fo CBT become critical, it should be by passed by zener diode
- (near Q4) (MMBF170)

### Library data of the parts
C30-C32 = Cap Semi: Capacitor (Semiconductor SIM Model); Published: 8-Jun-2000; LatestRevisionDate: 29-May-2009; LatestRevisionNote: IPC-7351 Footprint Added.; PackageReference: C1206; Publisher: Altium Limited; PackageDescription: Chip Capacitor
D9 = D Zener: Zener Diode; Published: 8-Jun-2000; LatestRevisionDate: 17-Jul-2002; LatestRevisionNote: Re-released for DXP Platform.; PackageReference: DIODE-0.7; Publisher: Altium Limited; PackageDescription: Diode, Thru-Hole; 2 Leads; 0.7 in Pin Spacing
P1 = Header 2: Header, 2-Pin; LatestRevisionDate: 17-Jul-2002; LatestRevisionNote: Re-released for DXP Platform.; Publisher: Altium Limited
Q4 = NMOS-2: as Q1 on sheet PCI-connector; Published: 8-Jun-2000; LatestRevisionDate: 17-Jul-2002; LatestRevisionNote: Re-released for DXP Platform.; DatasheetVersion: PD-9.814; PackageVersion: Feb-1997; PackageReference: TO-220AB; Publisher: Altium Limited; PackageDescription: TO, Thru-Hole, Vertical, Heatsink Mounted; 3 In-Line Leads; Pitch 2.54 mm; ComponentLink1Description: Manufacturer Link; ComponentLink1URL: http://www.irf.com/
R24 R25 R63-R66 = Res1: Resistor; Published: 8-Jun-2000; LatestRevisionDate: 17-Jul-2002; LatestRevisionNote: Re-released for DXP Platform.; PackageReference: AXIAL-0.3; Publisher: Altium Limited; PackageDescription: Axial Device, Thru-Hole; 2 Leads; 0.3 in Pin Spacing
U5-U7 = SN74CBTD16210: 20-BIT FET BUS SWITCH WITH LEVEL SHIFTING

## Sheet Spartan6-Power.SchDoc
size A
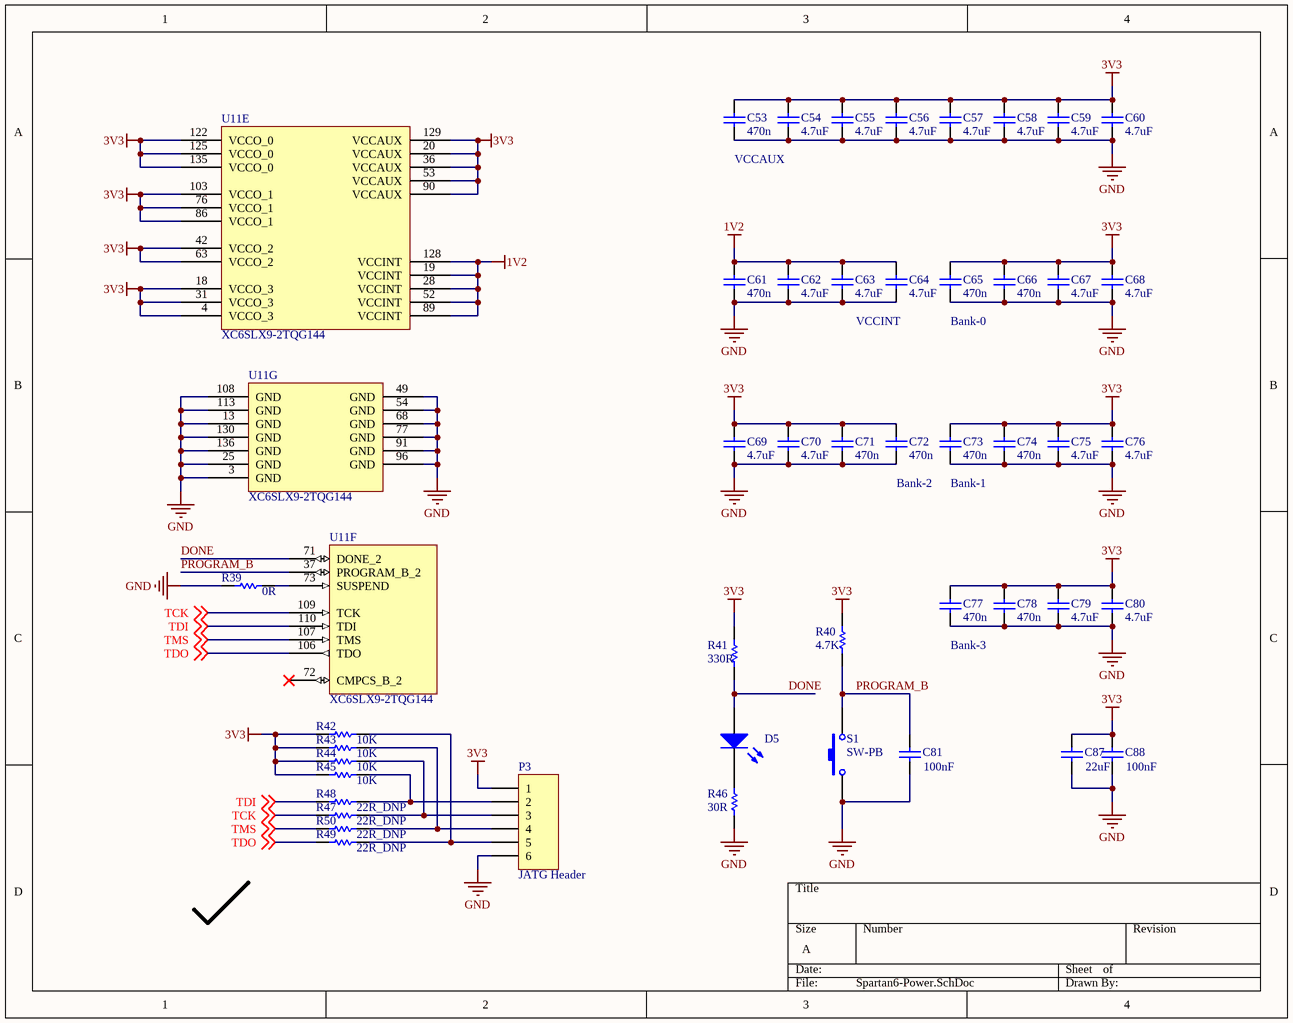
[diagram p6: Spartan6-Power.SchDoc]

### Parts
C53  value 470n  [0402]  (hidden comment: Cap Semi)
C54  value 4.7uF  [0603PKG]  (hidden comment: Cap Semi)
C55  value 4.7uF  [0603PKG]  (hidden comment: Cap Semi)
C56  value 4.7uF  [0603PKG]  (hidden comment: Cap Semi)
C57  value 4.7uF  [0603PKG]  (hidden comment: Cap Semi)
C58  value 4.7uF  [0603PKG]  (hidden comment: Cap Semi)
C59  value 4.7uF  [0603PKG]  (hidden comment: Cap Semi)
C60  value 4.7uF  [0603PKG]  (hidden comment: Cap Semi)
C61  value 470n  [0402]  (hidden comment: Cap Semi)
C62  value 4.7uF  [0603PKG]  (hidden comment: Cap Semi)
C63  value 4.7uF  [0603PKG]  (hidden comment: Cap Semi)
C64  value 4.7uF  [0603PKG]  (hidden comment: Cap Semi)
C65  value 470n  [0402]  (hidden comment: Cap Semi)
C66  value 470n  [0402]  (hidden comment: Cap Semi)
C67  value 4.7uF  [0603PKG]  (hidden comment: Cap Semi)
C68  value 4.7uF  [0603PKG]  (hidden comment: Cap Semi)
C69  value 4.7uF  [0603PKG]  (hidden comment: Cap Semi)
C70  value 4.7uF  [0603PKG]  (hidden comment: Cap Semi)
C71  value 470n  [0402]  (hidden comment: Cap Semi)
C72  value 470n  [0402]  (hidden comment: Cap Semi)
C73  value 470n  [0402]  (hidden comment: Cap Semi)
C74  value 470n  [0402]  (hidden comment: Cap Semi)
C75  value 4.7uF  [0603PKG]  (hidden comment: Cap Semi)
C76  value 4.7uF  [0603PKG]  (hidden comment: Cap Semi)
C77  value 470n  [0402]  (hidden comment: Cap Semi)
C78  value 470n  [0402]  (hidden comment: Cap Semi)
C79  value 4.7uF  [0603PKG]  (hidden comment: Cap Semi)
C80  value 4.7uF  [0603PKG]  (hidden comment: Cap Semi)
C81  value 100nF  [C0805]  (hidden comment: Cap)
C87  value 22uF  [C1206]  (hidden comment: Cap)
C88  value 100nF  [C0805]  (hidden comment: Cap)
D5  LED0  [C0805]  (value not drawn)
P3  JATG Header  [HDR1X6]
R39  value 0R  [0603PKG]  (hidden comment: Res1)
R40  value 4.7K  [0603PKG]  (hidden comment: Res1)
R41  value 330R  [0603PKG]  (hidden comment: Res1)
R42  value 10K  [0603PKG]  (hidden comment: Res Semi)
R43  value 10K  [0603PKG]  (hidden comment: Res Semi)
R44  value 10K  [0603PKG]  (hidden comment: Res Semi)
R45  value 10K  [0603PKG]  (hidden comment: Res Semi)
R46  value 30R  [0603PKG]  (hidden comment: Res1)
R47  value 22R_DNP  [0603PKG]  (hidden comment: Res Semi)
R48  value 22R_DNP  [0603PKG]  (hidden comment: Res Semi)
R49  value 22R_DNP  [0603PKG]  (hidden comment: Res Semi)
R50  value 22R_DNP  [0603PKG]  (hidden comment: Res Semi)
S1  SW-PB  [SMD push button]
U11  XC6SLX9-2TQG144  [TQG144]  (parts E,F,G of 7)

### Nets
1V2: C61.1 C62.1 C63.1 C64.1 U11.19(VCCINT) U11.28(VCCINT) U11.52(VCCINT) U11.89(VCCINT) U11.128(VCCINT)
3V3: C53.1 C54.1 C55.1 C56.1 C57.1 C58.1 C59.1 C60.1 C65.1 C66.1 C67.1 C68.1 C69.1 C70.1 C71.1 C72.1 C73.1 C74.1 C75.1 C76.1 C77.1 C78.1 C79.1 C80.1 C87.2 C88.2 P3.1 R40.2 R41.2 R42.2 R43.2 R44.2 R45.2 U11.4(VCCO_3) U11.18(VCCO_3) U11.20(VCCAUX) U11.31(VCCO_3) U11.36(VCCAUX) U11.42(VCCO_2) U11.53(VCCAUX) U11.63(VCCO_2) U11.76(VCCO_1) U11.86(VCCO_1) U11.90(VCCAUX) U11.103(VCCO_1) U11.122(VCCO_0) U11.125(VCCO_0) U11.129(VCCAUX) U11.135(VCCO_0)
GND: C53.2 C54.2 C55.2 C56.2 C57.2 C58.2 C59.2 C60.2 C61.2 C62.2 C63.2 C64.2 C65.2 C66.2 C67.2 C68.2 C69.2 C70.2 C71.2 C72.2 C73.2 C74.2 C75.2 C76.2 C77.2 C78.2 C79.2 C80.2 C81.1 C87.1 C88.1 P3.6 R39.1 R46.1 S1.1 U11.3(GND) U11.13(GND) U11.25(GND) U11.49(GND) U11.54(GND) U11.68(GND) U11.77(GND) U11.91(GND) U11.96(GND) U11.108(GND) U11.113(GND) U11.130(GND) U11.136(GND)
DONE: D5.1(A) R41.1 U11.71(DONE_2)
PROGRAM_B: C81.2 R40.1 S1.2 U11.37(PROGRAM_B_2)
TCK: R47.2 U11.109(TCK) ; off-sheet TCK
TDI: R48.2 U11.110(TDI) ; off-sheet TDI
TDO: R49.2 U11.106(TDO) ; off-sheet TDO
TMS: R50.2 U11.107(TMS) ; off-sheet TMS
NetD5_2: D5.2(K) R46.2
NetP3_2: P3.2 R45.1 R48.1
NetP3_3: P3.3 R44.1 R47.1
NetP3_4: P3.4 R43.1 R50.1
NetP3_5: P3.5 R42.1 R49.1
NetR39_2: R39.2 U11.73(SUSPEND)

Not connected (* = marked no-connect by the designer): U11 72(CMPCS_B_2)*

### Notes on the sheet
- VCCAUX
- VCCINT
- Bank-0
- Bank-2
- Bank-1
- Bank-3

### Library data of the parts
C53-C80 = Cap Semi: Capacitor (Semiconductor SIM Model); Published: 8-Jun-2000; LatestRevisionDate: 29-May-2009; LatestRevisionNote: IPC-7351 Footprint Added.; PackageReference: C1206; Publisher: Altium Limited; PackageDescription: Chip Capacitor
C81 C87 C88 = Cap: Capacitor; Published: 8-Jun-2000; LatestRevisionDate: 17-Jul-2002; LatestRevisionNote: Re-released for DXP Platform.; PackageReference: RAD-0.3; Publisher: Altium Limited; PackageDescription: Radial Cap, Thru-Hole; 2 Leads; 0.3 in Pin Spacing
D5 = LED0: Typical INFRARED GaAs LED; Published: 8-Jun-2000; LatestRevisionDate: 08-Jul-2005; LatestRevisionNote: Mech Layer 1 removed.; PackageReference: LED-0; Publisher: Altium Limited; PackageDescription: LED; 2 Leads
P3 = Header 6: Header, 6-Pin; LatestRevisionDate: 17-Jul-2002; LatestRevisionNote: Re-released for DXP Platform.; Publisher: Altium Limited
R39-R41 R46 = Res1: Resistor; Published: 8-Jun-2000; LatestRevisionDate: 17-Jul-2002; LatestRevisionNote: Re-released for DXP Platform.; PackageReference: AXIAL-0.3; Publisher: Altium Limited; PackageDescription: Axial Device, Thru-Hole; 2 Leads; 0.3 in Pin Spacing
R42-R45 R47-R50 = Res Semi: Semiconductor Resistor; Published: 8-Jun-2000; LatestRevisionDate: 17-Jul-2002; LatestRevisionNote: Re-released for DXP Platform.; PackageReference: AXIAL-0.5; Publisher: Altium Limited; PackageDescription: Axial Device, Thru-Hole; 2 Leads; 0.5 in Pin Spacing
S1 = SW-PB: Switch; Published: 24-Mar-1999; LatestRevisionDate: 17-Jul-2002; LatestRevisionNote: Re-released for DXP Platform.; PackageReference: SPST-2; Publisher: Altium Limited; PackageDescription: Switch; 2 Leads
U11 = XC6SLX9-2TQG144C: Xilinx Spartan6 LX9

## Sheet Spartan6-IO01.SchDoc
size A
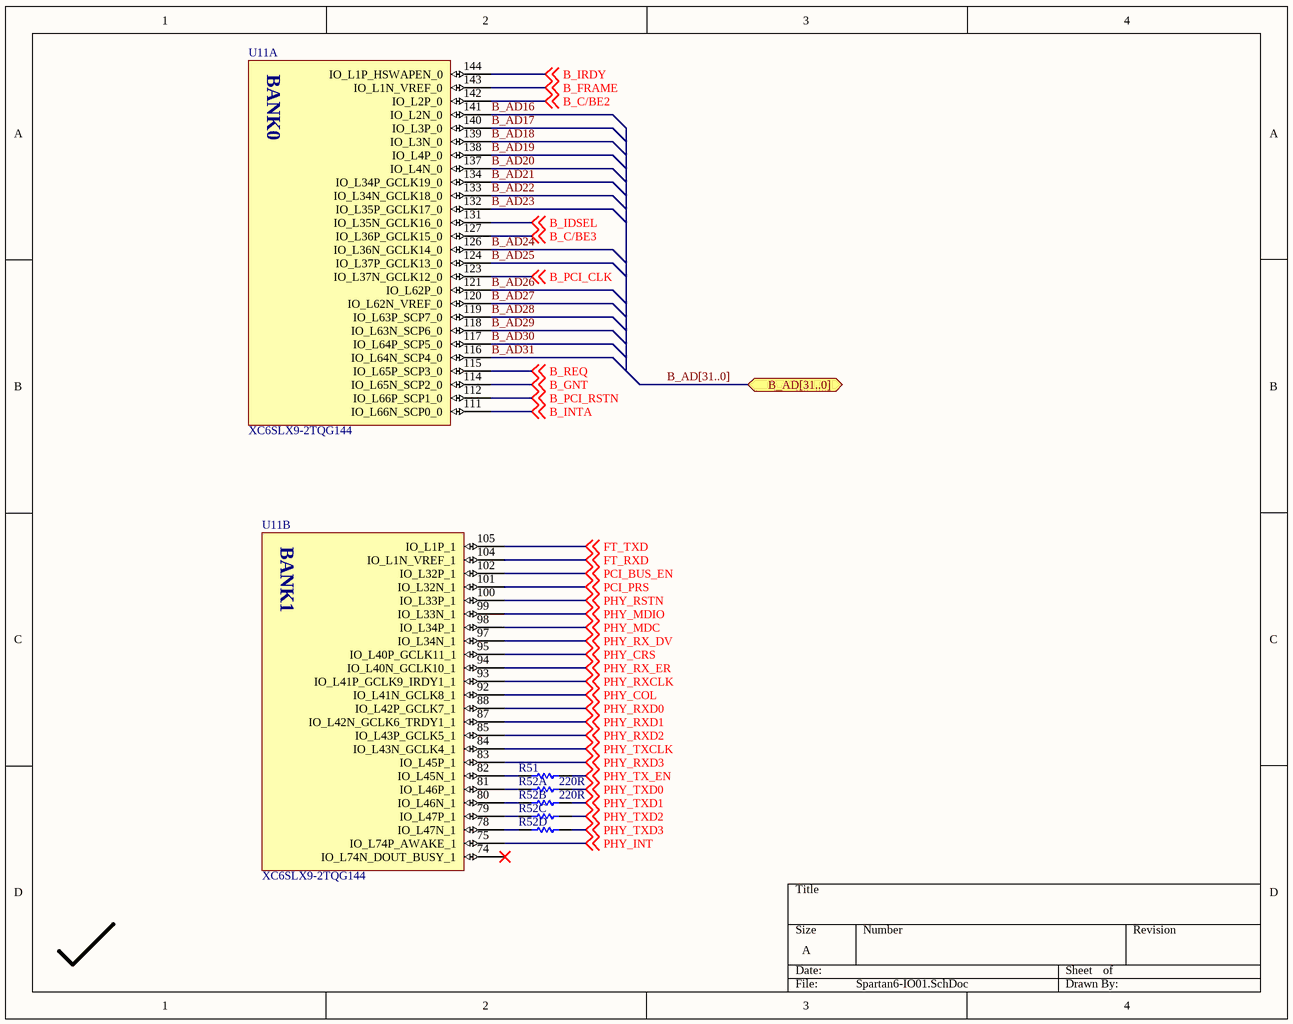
[diagram p7: Spartan6-IO01.SchDoc]

### Parts
R51  value 220R  [0603PKG]  (hidden comment: Res Semi)
R52  value 220R  [ARA4x0603]  (hidden comment: ChipArray_4x)  (parts A,B,C,D of 4)
U11  XC6SLX9-2TQG144  [TQG144]  (parts A,B of 7)

### Ports
B_AD[31..0]

### Nets
B_AD16: U11.141(IO_L2N_0)
B_AD17: U11.140(IO_L3P_0)
B_AD18: U11.139(IO_L3N_0)
B_AD19: U11.138(IO_L4P_0)
B_AD20: U11.137(IO_L4N_0)
B_AD21: U11.134(IO_L34P_GCLK19_0)
B_AD22: U11.133(IO_L34N_GCLK18_0)
B_AD23: U11.132(IO_L35P_GCLK17_0)
B_AD24: U11.126(IO_L36N_GCLK14_0)
B_AD25: U11.124(IO_L37P_GCLK13_0)
B_AD26: U11.121(IO_L62P_0)
B_AD27: U11.120(IO_L62N_VREF_0)
B_AD28: U11.119(IO_L63P_SCP7_0)
B_AD29: U11.118(IO_L63N_SCP6_0)
B_AD30: U11.117(IO_L64P_SCP5_0)
B_AD31: U11.116(IO_L64N_SCP4_0)
B_C/BE2: U11.142(IO_L2P_0) ; off-sheet B_C/BE2
B_C/BE3: U11.127(IO_L36P_GCLK15_0) ; off-sheet B_C/BE3
B_FRAME: U11.143(IO_L1N_VREF_0) ; off-sheet B_FRAME
B_GNT: U11.114(IO_L65N_SCP2_0) ; off-sheet B_GNT
B_IDSEL: U11.131(IO_L35N_GCLK16_0) ; off-sheet B_IDSEL
B_INTA: U11.111(IO_L66N_SCP0_0) ; off-sheet B_INTA
B_IRDY: U11.144(IO_L1P_HSWAPEN_0) ; off-sheet B_IRDY
B_PCI_CLK: U11.123(IO_L37N_GCLK12_0) ; off-sheet B_PCI_CLK
B_PCI_RSTN: U11.112(IO_L66P_SCP1_0) ; off-sheet B_PCI_RSTN
B_REQ: U11.115(IO_L65P_SCP3_0) ; off-sheet B_REQ
FT_RXD: U11.104(IO_L1N_VREF_1) ; off-sheet FT_RXD
FT_TXD: U11.105(IO_L1P_1) ; off-sheet FT_TXD
PCI_BUS_EN: U11.102(IO_L32P_1) ; off-sheet PCI_BUS_EN
PCI_PRS: U11.101(IO_L32N_1) ; off-sheet PCI_PRS
PHY_COL: U11.92(IO_L41N_GCLK8_1) ; off-sheet PHY_COL
PHY_CRS: U11.95(IO_L40P_GCLK11_1) ; off-sheet PHY_CRS
PHY_INT: U11.75(IO_L74P_AWAKE_1) ; off-sheet PHY_INT
PHY_MDC: U11.98(IO_L34P_1) ; off-sheet PHY_MDC
PHY_MDIO: U11.99(IO_L33N_1) ; off-sheet PHY_MDIO
PHY_RSTN: U11.100(IO_L33P_1) ; off-sheet PHY_RSTN
PHY_RX_DV: U11.97(IO_L34N_1) ; off-sheet PHY_RX_DV
PHY_RX_ER: U11.94(IO_L40N_GCLK10_1) ; off-sheet PHY_RX_ER
PHY_RXCLK: U11.93(IO_L41P_GCLK9_IRDY1_1) ; off-sheet PHY_RXCLK
PHY_RXD0: U11.88(IO_L42P_GCLK7_1) ; off-sheet PHY_RXD0
PHY_RXD1: U11.87(IO_L42N_GCLK6_TRDY1_1) ; off-sheet PHY_RXD1
PHY_RXD2: U11.85(IO_L43P_GCLK5_1) ; off-sheet PHY_RXD2
PHY_RXD3: U11.83(IO_L45P_1) ; off-sheet PHY_RXD3
PHY_TX_EN: R51.2 ; off-sheet PHY_TX_EN
PHY_TXCLK: U11.84(IO_L43N_GCLK4_1) ; off-sheet PHY_TXCLK
PHY_TXD0: R52.8(R1) ; off-sheet PHY_TXD0
PHY_TXD1: R52.7(R2) ; off-sheet PHY_TXD1
PHY_TXD2: R52.6(R3) ; off-sheet PHY_TXD2
PHY_TXD3: R52.5(R4) ; off-sheet PHY_TXD3
NetR51_1: R51.1 U11.82(IO_L45N_1)
NetR52_1: R52.1(R1) U11.81(IO_L46P_1)
NetR52_2: R52.2(R2) U11.80(IO_L46N_1)
NetR52_3: R52.3(R3) U11.79(IO_L47P_1)
NetR52_4: R52.4(R4) U11.78(IO_L47N_1)

Not connected (* = marked no-connect by the designer): U11 74(IO_L74N_DOUT_BUSY_1)*

### Buses and harness runs
bus B_AD[31..0] = port B_AD[31..0]

### Notes on the sheet
- (in symbol XC6SLX9-2TQG144C, part A) BANK0
- (in symbol XC6SLX9-2TQG144C, part B) BANK1

### Library data of the parts
R51 = Res Semi: Semiconductor Resistor; Published: 8-Jun-2000; LatestRevisionDate: 17-Jul-2002; LatestRevisionNote: Re-released for DXP Platform.; PackageReference: AXIAL-0.5; Publisher: Altium Limited; PackageDescription: Axial Device, Thru-Hole; 2 Leads; 0.5 in Pin Spacing
U11 = XC6SLX9-2TQG144C: Xilinx Spartan6 LX9

## Sheet Spartan6-IO23.SchDoc
size A
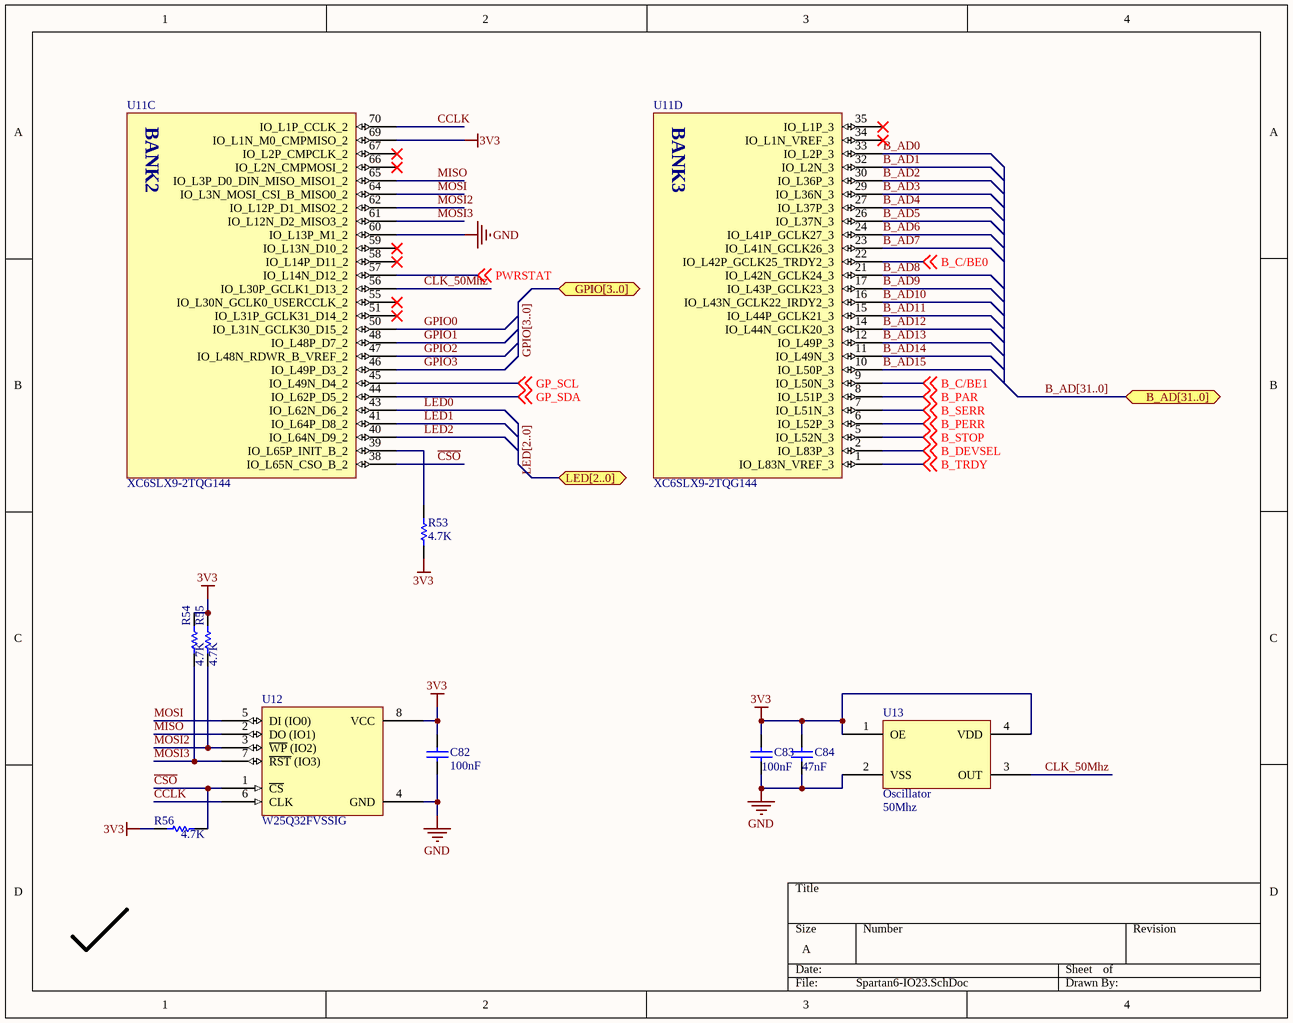
[diagram p8: Spartan6-IO23.SchDoc]

### Parts
C82  value 100nF  [0603PKG]  (hidden comment: Cap Semi)
C83  value 100nF  [0603PKG]  (hidden comment: Cap)
C84  value 47nF  [0603PKG]  (hidden comment: Cap)
R53  value 4.7K  [0603PKG]  (hidden comment: Res1)
R54  value 4.7K  [0603PKG]  (hidden comment: Res1)
R55  value 4.7K  [0603PKG]  (hidden comment: Res1)
R56  value 4.7K  [0603PKG]  (hidden comment: Res1)
U11  XC6SLX9-2TQG144  [TQG144]  (parts C,D of 7)
U12  W25Q32FVSSIG  [SSOP8]
U13  Oscillator  Freq: 50Mhz  [Crystal5x7]

### Ports
B_AD[31..0], GPIO[3..0], LED[2..0]

### Nets
3V3: C82.1 C83.2 C84.2 R53.2 R54.2 R55.2 R56.1 U11.69(IO_L1N_M0_CMPMISO_2) U12.8(VCC) U13.1(OE) U13.4(VDD)
GND: C82.2 C83.1 C84.1 U11.60(IO_L13P_M1_2) U12.4(GND) U13.2(VSS)
B_AD0: U11.33(IO_L2P_3)
B_AD1: U11.32(IO_L2N_3)
B_AD2: U11.30(IO_L36P_3)
B_AD3: U11.29(IO_L36N_3)
B_AD4: U11.27(IO_L37P_3)
B_AD5: U11.26(IO_L37N_3)
B_AD6: U11.24(IO_L41P_GCLK27_3)
B_AD7: U11.23(IO_L41N_GCLK26_3)
B_AD8: U11.21(IO_L42N_GCLK24_3)
B_AD9: U11.17(IO_L43P_GCLK23_3)
B_AD10: U11.16(IO_L43N_GCLK22_IRDY2_3)
B_AD11: U11.15(IO_L44P_GCLK21_3)
B_AD12: U11.14(IO_L44N_GCLK20_3)
B_AD13: U11.12(IO_L49P_3)
B_AD14: U11.11(IO_L49N_3)
B_AD15: U11.10(IO_L50P_3)
B_C/BE0: U11.22(IO_L42P_GCLK25_TRDY2_3) ; off-sheet B_C/BE0
B_C/BE1: U11.9(IO_L50N_3) ; off-sheet B_C/BE1
B_DEVSEL: U11.2(IO_L83P_3) ; off-sheet B_DEVSEL
B_PAR: U11.8(IO_L51P_3) ; off-sheet B_PAR
B_PERR: U11.6(IO_L52P_3) ; off-sheet B_PERR
B_SERR: U11.7(IO_L51N_3) ; off-sheet B_SERR
B_STOP: U11.5(IO_L52N_3) ; off-sheet B_STOP
B_TRDY: U11.1(IO_L83N_VREF_3) ; off-sheet B_TRDY
~{CSO}: R56.2 U11.38(IO_L65N_CSO_B_2) U12.1(~{CS})
CCLK: U11.70(IO_L1P_CCLK_2) U12.6(CLK)
CLK_50Mhz: U11.56(IO_L30P_GCLK1_D13_2) U13.3(OUT)
GP_SCL: U11.45(IO_L49N_D4_2) ; off-sheet GP_SCL
GP_SDA: U11.44(IO_L62P_D5_2) ; off-sheet GP_SDA
GPIO0: U11.50(IO_L31N_GCLK30_D15_2)
GPIO1: U11.48(IO_L48P_D7_2)
GPIO2: U11.47(IO_L48N_RDWR_B_VREF_2)
GPIO3: U11.46(IO_L49P_D3_2)
LED0: U11.43(IO_L62N_D6_2)
LED1: U11.41(IO_L64P_D8_2)
LED2: U11.40(IO_L64N_D9_2)
MISO: U11.65(IO_L3P_D0_DIN_MISO_MISO1_2) U12.2(DO_(IO1))
MOSI: U11.64(IO_L3N_MOSI_CSI_B_MISO0_2) U12.5(DI_(IO0))
MOSI2: R55.1 U11.62(IO_L12P_D1_MISO2_2) U12.3(~{WP}_(IO2))
MOSI3: R54.1 U11.61(IO_L12N_D2_MISO3_2) U12.7(~{RST}_(IO3))
PWRSTAT: U11.57(IO_L14N_D12_2) ; off-sheet PWRSTAT
NetR53_1: R53.1 U11.39(IO_L65P_INIT_B_2)

Not connected (* = marked no-connect by the designer): U11 34(IO_L1N_VREF_3)* 35(IO_L1P_3)* 51(IO_L31P_GCLK31_D14_2)* 55(IO_L30N_GCLK0_USERCCLK_2)* 58(IO_L14P_D11_2)* 59(IO_L13N_D10_2)* 66(IO_L2N_CMPMOSI_2)* 67(IO_L2P_CMPCLK_2)*

### Buses and harness runs
bus B_AD[31..0] = port B_AD[31..0]
bus GPIO[3..0] = port GPIO[3..0]
bus LED[2..0] = port LED[2..0]

### Notes on the sheet
- (in symbol XC6SLX9-2TQG144C, part C) BANK2
- (in symbol XC6SLX9-2TQG144C, part D) BANK3

### Library data of the parts
C82 = Cap Semi: Capacitor (Semiconductor SIM Model); Published: 8-Jun-2000; LatestRevisionDate: 29-May-2009; LatestRevisionNote: IPC-7351 Footprint Added.; PackageReference: C1206; Publisher: Altium Limited; PackageDescription: Chip Capacitor
C83 C84 = Cap: Capacitor; Published: 8-Jun-2000; LatestRevisionDate: 17-Jul-2002; LatestRevisionNote: Re-released for DXP Platform.; PackageReference: RAD-0.3; Publisher: Altium Limited; PackageDescription: Radial Cap, Thru-Hole; 2 Leads; 0.3 in Pin Spacing
R53-R56 = Res1: Resistor; Published: 8-Jun-2000; LatestRevisionDate: 17-Jul-2002; LatestRevisionNote: Re-released for DXP Platform.; PackageReference: AXIAL-0.3; Publisher: Altium Limited; PackageDescription: Axial Device, Thru-Hole; 2 Leads; 0.3 in Pin Spacing
U11 = XC6SLX9-2TQG144C: Xilinx Spartan6 LX9

## Sheet Peripherals.SchDoc
size A
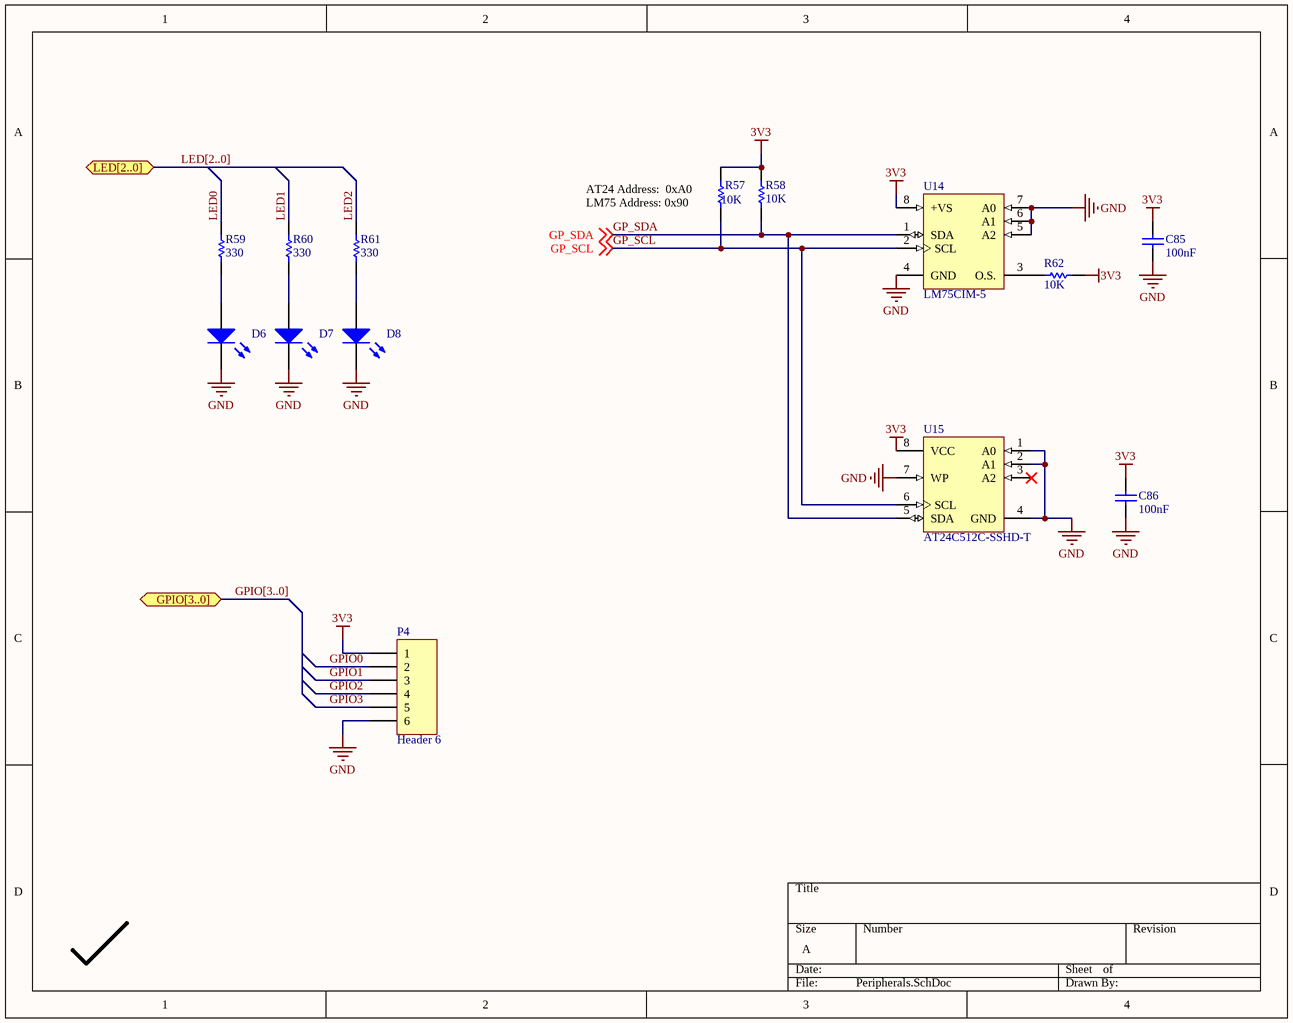
[diagram p9: Peripherals.SchDoc]

### Parts
C85  value 100nF  [0603PKG]  (hidden comment: Cap)
C86  value 100nF  [0603PKG]  (hidden comment: Cap)
D6  LED0  [C0805]  (value not drawn)
D7  LED0  [C0805]  (value not drawn)
D8  LED0  [C0805]  (value not drawn)
P4  Header 6  [HDR1X6]
R57  value 10K  [0603PKG]  (hidden comment: Res Semi)
R58  value 10K  [0603PKG]  (hidden comment: Res Semi)
R59  value 330  [0603PKG]  (hidden comment: Res Semi)
R60  value 330  [0603PKG]  (hidden comment: Res Semi)
R61  value 330  [0603PKG]  (hidden comment: Res Semi)
R62  value 10K  [0603PKG]  (hidden comment: Res Semi)
U14  LM75CIM-5  [8S1_N]
U15  AT24C512C-SSHD-T  [8S1_N]

### Ports
GPIO[3..0], LED[2..0]

### Nets
3V3: C85.2 C86.2 P4.1 R57.1 R58.1 R62.1 U14.8(+VS) U15.8(VCC)
GND: C85.1 C86.1 D6.2(K) D7.2(K) D8.2(K) P4.6 U14.4(GND) U14.5(A2) U14.6(A1) U14.7(A0) U15.1(A0) U15.2(A1) U15.4(GND) U15.7(WP)
GP_SCL: R57.2 U14.2(SCL) U15.6(SCL) ; off-sheet GP_SCL
GP_SDA: R58.2 U14.1(SDA) U15.5(SDA) ; off-sheet GP_SDA
GPIO0: P4.2
GPIO1: P4.3
GPIO2: P4.4
GPIO3: P4.5
LED0: R59.2
LED1: R60.2
LED2: R61.2
NetD6_1: D6.1(A) R59.1
NetD7_1: D7.1(A) R60.1
NetD8_1: D8.1(A) R61.1
NetR62_2: R62.2 U14.3(O.S.)

Not connected (* = marked no-connect by the designer): U15 3(A2)*

### Buses and harness runs
bus GPIO[3..0] = port GPIO[3..0]
bus LED[2..0] = port LED[2..0]

### Notes on the sheet
- (near R57) AT24 Address:  0xA0
  LM75 Address: 0x90

### Library data of the parts
C85 C86 = Cap: Capacitor; Published: 8-Jun-2000; LatestRevisionDate: 17-Jul-2002; LatestRevisionNote: Re-released for DXP Platform.; PackageReference: RAD-0.3; Publisher: Altium Limited; PackageDescription: Radial Cap, Thru-Hole; 2 Leads; 0.3 in Pin Spacing
D6-D8 = LED0: Typical INFRARED GaAs LED; Published: 8-Jun-2000; LatestRevisionDate: 08-Jul-2005; LatestRevisionNote: Mech Layer 1 removed.; PackageReference: LED-0; Publisher: Altium Limited; PackageDescription: LED; 2 Leads
P4 = Header 6: Header, 6-Pin; LatestRevisionDate: 17-Jul-2002; LatestRevisionNote: Re-released for DXP Platform.; Publisher: Altium Limited
R57-R62 = Res Semi: Semiconductor Resistor; Published: 8-Jun-2000; LatestRevisionDate: 17-Jul-2002; LatestRevisionNote: Re-released for DXP Platform.; PackageReference: AXIAL-0.5; Publisher: Altium Limited; PackageDescription: Axial Device, Thru-Hole; 2 Leads; 0.5 in Pin Spacing
U14 = LM75CIMMX-5/NOPB: Digital Temperature Sensor and Thermal Watchdog with Two-Wire Interface, 8 pin MINI SOIC; Manufacturer: National Semiconductor; PackageTopMarking: ZXTT*T00C; PowerWise: N; CompType: Temp Sensor IC; High-Reliability: Y; DatasheetVersion: Jul-2009; PackageVersion: revF, Apr-2008; PackageReference: MUA08A; PackageDescription: MINI SOIC, .118 x .118 x .034in, 8 Lead, .0256in Pitch; PartNumber: LM75CIMMX-5/NOPB; RoHS: Y; PinCount: 8; Code_JEDEC: MO-187-AA; ComponentLink1Description: Manufacturer URL; ComponentLink1URL: http://www.national.com/; ComponentLink2Description: LM75C Datasheet; ComponentLink2URL: http://www.national.com/ds/LM/LM75C.pdf; ComponentLink3Description: LM75C Web Page; ComponentLink3URL: http://www.national.com/pf/LM/LM75C.html; ComponentLink4Description: MUA08A Package Page; ComponentLink4URL: http://www.national.com/packaging/folders/mua08a.html
U15 = AT24C01BN-SP25-B: 1Kbit (128 x 8), 2-wire Bus Automotive Serial EEPROM with Write Protect, 2.5V, 8-Pin SOIC, Bulk; DatasheetVersion: 8517C,  Jan-2009; PackageVersion: revC, Mar-2005; PackageReference: 8S1; PackageDescription: 8-Lead (0.150" Wide Body), Plastic Gull Wing Small Outline (JEDEC SOIC); Code_JEDEC: MS-012-AA; Code_IPC: SOIC127P600-8; ComponentLink1Description: Manufacturer URL; ComponentLink1URL: http://www.atmel.com/; ComponentLink2Description: Datasheet; ComponentLink2URL: http://www.atmel.com/dyn/resources/prod_documents/doc8517.pdf

## Nets that join several sheets
1V2: Power (C21.2 C26.2 U4.2 U4.4), Spartan6-Power (9 pins)
3V3: Network (21 pins), Power (5 pins), Programmer-JTAG (22 pins), Bus-switch (R64.2), Spartan6-Power (49 pins), Spartan6-IO23 (11 pins), Peripherals (8 pins)
5V0: Power (13 pins), Bus-switch (R24.2 R63.2)
5V0_PCI: PCI-connector (5 pins), Power (C20.2 Q3.3 TP1.1 U2.1)
5V0_USB: Power (Q2.3), Programmer-JTAG (C34.2 L1.2 R30.2)
GND: PCI-connector (22 pins), Network (23 pins), Power (16 pins), Programmer-JTAG (34 pins), Bus-switch (19 pins), Spartan6-Power (48 pins), Spartan6-IO23 (6 pins), Peripherals (14 pins)
AD0: PCI-connector (J1.A58), Bus-switch (U5.24)
AD1: PCI-connector (J1.B58), Bus-switch (U5.23)
AD2: PCI-connector (J1.A57), Bus-switch (U5.22)
AD3: PCI-connector (J1.B56), Bus-switch (U5.21)
AD4: PCI-connector (J1.A55), Bus-switch (U5.20)
AD5: PCI-connector (J1.B55), Bus-switch (U5.19)
AD6: PCI-connector (J1.A54), Bus-switch (U5.18)
AD7: PCI-connector (J1.B53), Bus-switch (U5.16)
AD8: PCI-connector (J1.B52), Bus-switch (U5.13)
AD9: PCI-connector (J1.A49), Bus-switch (U7.24)
AD10: PCI-connector (J1.B48), Bus-switch (U7.23)
AD11: PCI-connector (J1.A47), Bus-switch (U7.22)
AD12: PCI-connector (J1.B47), Bus-switch (U7.21)
AD13: PCI-connector (J1.A46), Bus-switch (U7.20)
AD14: PCI-connector (J1.B45), Bus-switch (U7.19)
AD15: PCI-connector (J1.A44), Bus-switch (U7.18)
AD16: PCI-connector (J1.A32), Bus-switch (U7.4)
AD17: PCI-connector (J1.B32), Bus-switch (U7.3)
AD18: PCI-connector (J1.A31), Bus-switch (U7.2)
AD19: PCI-connector (J1.B30), Bus-switch (U6.24)
AD20: PCI-connector (J1.A29), Bus-switch (U6.23)
AD21: PCI-connector (J1.B29), Bus-switch (U6.22)
AD22: PCI-connector (J1.A28), Bus-switch (U6.21)
AD23: PCI-connector (J1.B27), Bus-switch (U6.20)
AD24: PCI-connector (J1.A25), Bus-switch (U6.16)
AD25: PCI-connector (J1.B24), Bus-switch (U6.14)
AD26: PCI-connector (J1.A23), Bus-switch (U6.13)
AD27: PCI-connector (J1.B23), Bus-switch (U6.12)
AD28: PCI-connector (J1.A22), Bus-switch (U6.11)
AD29: PCI-connector (J1.B21), Bus-switch (U6.10)
AD30: PCI-connector (J1.A20), Bus-switch (U6.9)
AD31: PCI-connector (J1.B20), Bus-switch (U6.7)
B_AD0: Bus-switch (U5.25), Spartan6-IO23 (U11.33)
B_AD1: Bus-switch (U5.26), Spartan6-IO23 (U11.32)
B_AD2: Bus-switch (U5.27), Spartan6-IO23 (U11.30)
B_AD3: Bus-switch (U5.28), Spartan6-IO23 (U11.29)
B_AD4: Bus-switch (U5.29), Spartan6-IO23 (U11.27)
B_AD5: Bus-switch (U5.30), Spartan6-IO23 (U11.26)
B_AD6: Bus-switch (U5.31), Spartan6-IO23 (U11.24)
B_AD7: Bus-switch (U5.33), Spartan6-IO23 (U11.23)
B_AD8: Bus-switch (U5.35), Spartan6-IO23 (U11.21)
B_AD9: Bus-switch (U7.25), Spartan6-IO23 (U11.17)
B_AD10: Bus-switch (U7.26), Spartan6-IO23 (U11.16)
B_AD11: Bus-switch (U7.27), Spartan6-IO23 (U11.15)
B_AD12: Bus-switch (U7.28), Spartan6-IO23 (U11.14)
B_AD13: Bus-switch (U7.29), Spartan6-IO23 (U11.12)
B_AD14: Bus-switch (U7.30), Spartan6-IO23 (U11.11)
B_AD15: Bus-switch (U7.31), Spartan6-IO23 (U11.10)
B_AD16: Bus-switch (U7.44), Spartan6-IO01 (U11.141)
B_AD17: Bus-switch (U7.45), Spartan6-IO01 (U11.140)
B_AD18: Bus-switch (U7.46), Spartan6-IO01 (U11.139)
B_AD19: Bus-switch (U6.25), Spartan6-IO01 (U11.138)
B_AD20: Bus-switch (U6.26), Spartan6-IO01 (U11.137)
B_AD21: Bus-switch (U6.27), Spartan6-IO01 (U11.134)
B_AD22: Bus-switch (U6.28), Spartan6-IO01 (U11.133)
B_AD23: Bus-switch (U6.29), Spartan6-IO01 (U11.132)
B_AD24: Bus-switch (U6.33), Spartan6-IO01 (U11.126)
B_AD25: Bus-switch (U6.34), Spartan6-IO01 (U11.124)
B_AD26: Bus-switch (U6.35), Spartan6-IO01 (U11.121)
B_AD27: Bus-switch (U6.36), Spartan6-IO01 (U11.120)
B_AD28: Bus-switch (U6.37), Spartan6-IO01 (U11.119)
B_AD29: Bus-switch (U6.38), Spartan6-IO01 (U11.118)
B_AD30: Bus-switch (U6.39), Spartan6-IO01 (U11.117)
B_AD31: Bus-switch (U6.40), Spartan6-IO01 (U11.116)
B_C/BE0: Bus-switch (U5.34), Spartan6-IO23 (U11.22)
B_C/BE1: Bus-switch (U7.33), Spartan6-IO23 (U11.9)
B_C/BE2: Bus-switch (U7.43), Spartan6-IO01 (U11.142)
B_C/BE3: Bus-switch (U6.31), Spartan6-IO01 (U11.127)
B_DEVSEL: Bus-switch (U7.38), Spartan6-IO23 (U11.2)
B_FRAME: Bus-switch (U7.42), Spartan6-IO01 (U11.143)
B_GNT: Bus-switch (U6.43), Spartan6-IO01 (U11.114)
B_IDSEL: Bus-switch (U6.30), Spartan6-IO01 (U11.131)
B_INTA: Bus-switch (U6.46), Spartan6-IO01 (U11.111)
B_IRDY: Bus-switch (U7.40), Spartan6-IO01 (U11.144)
B_PAR: Bus-switch (U7.34), Spartan6-IO23 (U11.8)
B_PCI_CLK: Bus-switch (D9.2 R65.1 U6.44), Spartan6-IO01 (U11.123)
B_PCI_RSTN: Bus-switch (U6.45), Spartan6-IO01 (U11.112)
B_PERR: Bus-switch (U7.36), Spartan6-IO23 (U11.6)
B_REQ: Bus-switch (U6.42), Spartan6-IO01 (U11.115)
B_SERR: Bus-switch (U7.35), Spartan6-IO23 (U11.7)
B_STOP: Bus-switch (U7.37), Spartan6-IO23 (U11.5)
B_TRDY: Bus-switch (U7.39), Spartan6-IO23 (U11.1)
C/BE0: PCI-connector (J1.A52), Bus-switch (U5.14)
C/BE1: PCI-connector (J1.B44), Bus-switch (U7.16)
C/BE2: PCI-connector (J1.B33), Bus-switch (U7.5)
C/BE3: PCI-connector (J1.B26), Bus-switch (U6.18)
DEVSEL: PCI-connector (J1.B37), Bus-switch (U7.10)
FRAME: PCI-connector (J1.A34), Bus-switch (U7.6)
FT_RXD: Programmer-JTAG (U10.39), Spartan6-IO01 (U11.104)
FT_TXD: Programmer-JTAG (U10.38), Spartan6-IO01 (U11.105)
GNT: PCI-connector (J1.A17), Bus-switch (U6.5)
GP_SCL: Spartan6-IO23 (U11.45), Peripherals (R57.2 U14.2 U15.6)
GP_SDA: Spartan6-IO23 (U11.44), Peripherals (R58.2 U14.1 U15.5)
GPIO0: Spartan6-IO23 (U11.50), Peripherals (P4.2)
GPIO1: Spartan6-IO23 (U11.48), Peripherals (P4.3)
GPIO2: Spartan6-IO23 (U11.47), Peripherals (P4.4)
GPIO3: Spartan6-IO23 (U11.46), Peripherals (P4.5)
IDSEL: PCI-connector (J1.A26), Bus-switch (U6.19)
INTA: PCI-connector (J1.A6), Bus-switch (U6.2)
IRDY: PCI-connector (J1.B35), Bus-switch (U7.7)
LED0: Spartan6-IO23 (U11.43), Peripherals (R59.2)
LED1: Spartan6-IO23 (U11.41), Peripherals (R60.2)
LED2: Spartan6-IO23 (U11.40), Peripherals (R61.2)
PAR: PCI-connector (J1.A43), Bus-switch (U7.14)
PCI_BUS_EN: Bus-switch (Q4.1 R25.2), Spartan6-IO01 (U11.102)
PCI_CLK: PCI-connector (J1.B16), Bus-switch (R65.2 U6.4)
PCI_PRS: PCI-connector (Q1.1 R20.1), Spartan6-IO01 (U11.101)
PCI_RSTN: PCI-connector (J1.A15), Bus-switch (U6.3)
PERR: PCI-connector (J1.B40), Bus-switch (U7.12)
PHY_COL: Network (U1.42), Spartan6-IO01 (U11.92)
PHY_CRS: Network (R13.3), Spartan6-IO01 (U11.95)
PHY_INT: Network (U1.7), Spartan6-IO01 (U11.75)
PHY_MDC: Network (R14.1 U1.31), Spartan6-IO01 (U11.98)
PHY_MDIO: Network (R15.2 U1.30), Spartan6-IO01 (U11.99)
PHY_RSTN: Network (U1.29), Spartan6-IO01 (U11.100)
PHY_RX_DV: Network (R13.2), Spartan6-IO01 (U11.97)
PHY_RX_ER: Network (R13.4), Spartan6-IO01 (U11.94)
PHY_RXCLK: Network (R13.1), Spartan6-IO01 (U11.93)
PHY_RXD0: Network (R10.1), Spartan6-IO01 (U11.88)
PHY_RXD1: Network (R10.2), Spartan6-IO01 (U11.87)
PHY_RXD2: Network (R10.3), Spartan6-IO01 (U11.85)
PHY_RXD3: Network (R10.4), Spartan6-IO01 (U11.83)
PHY_TX_EN: Network (U1.2), Spartan6-IO01 (R51.2)
PHY_TXCLK: Network (R7.1), Spartan6-IO01 (U11.84)
PHY_TXD0: Network (U1.3), Spartan6-IO01 (R52.8)
PHY_TXD1: Network (U1.4), Spartan6-IO01 (R52.7)
PHY_TXD2: Network (U1.5), Spartan6-IO01 (R52.6)
PHY_TXD3: Network (U1.6), Spartan6-IO01 (R52.5)
PWRSTAT: Power (Q2.1 R22.1 U2.4), Spartan6-IO23 (U11.57)
REQ: PCI-connector (J1.B18), Bus-switch (U6.6)
SERR: PCI-connector (J1.B42), Bus-switch (U7.13)
STOP: PCI-connector (J1.A38), Bus-switch (U7.11)
TCK: Programmer-JTAG (R26.1), Spartan6-Power (R47.2 U11.109)
TDI: Programmer-JTAG (R27.1), Spartan6-Power (R48.2 U11.110)
TDO: Programmer-JTAG (R28.1), Spartan6-Power (R49.2 U11.106)
TMS: Programmer-JTAG (R29.1), Spartan6-Power (R50.2 U11.107)
TRDY: PCI-connector (J1.A36), Bus-switch (U7.9)